# EasyEDA Pro project ProPrj_风扇控制_2024-12-11.epro

# Schematic Schematic1
Board Name: Board1; Create Date: 2024-11-12; Page Name: P1; Project Name: 风扇控制; Schematic Name: Schematic1; Update Date: 2024-11-16; Company: 嘉立创EDA; Page Size: A4; Version: V1.0
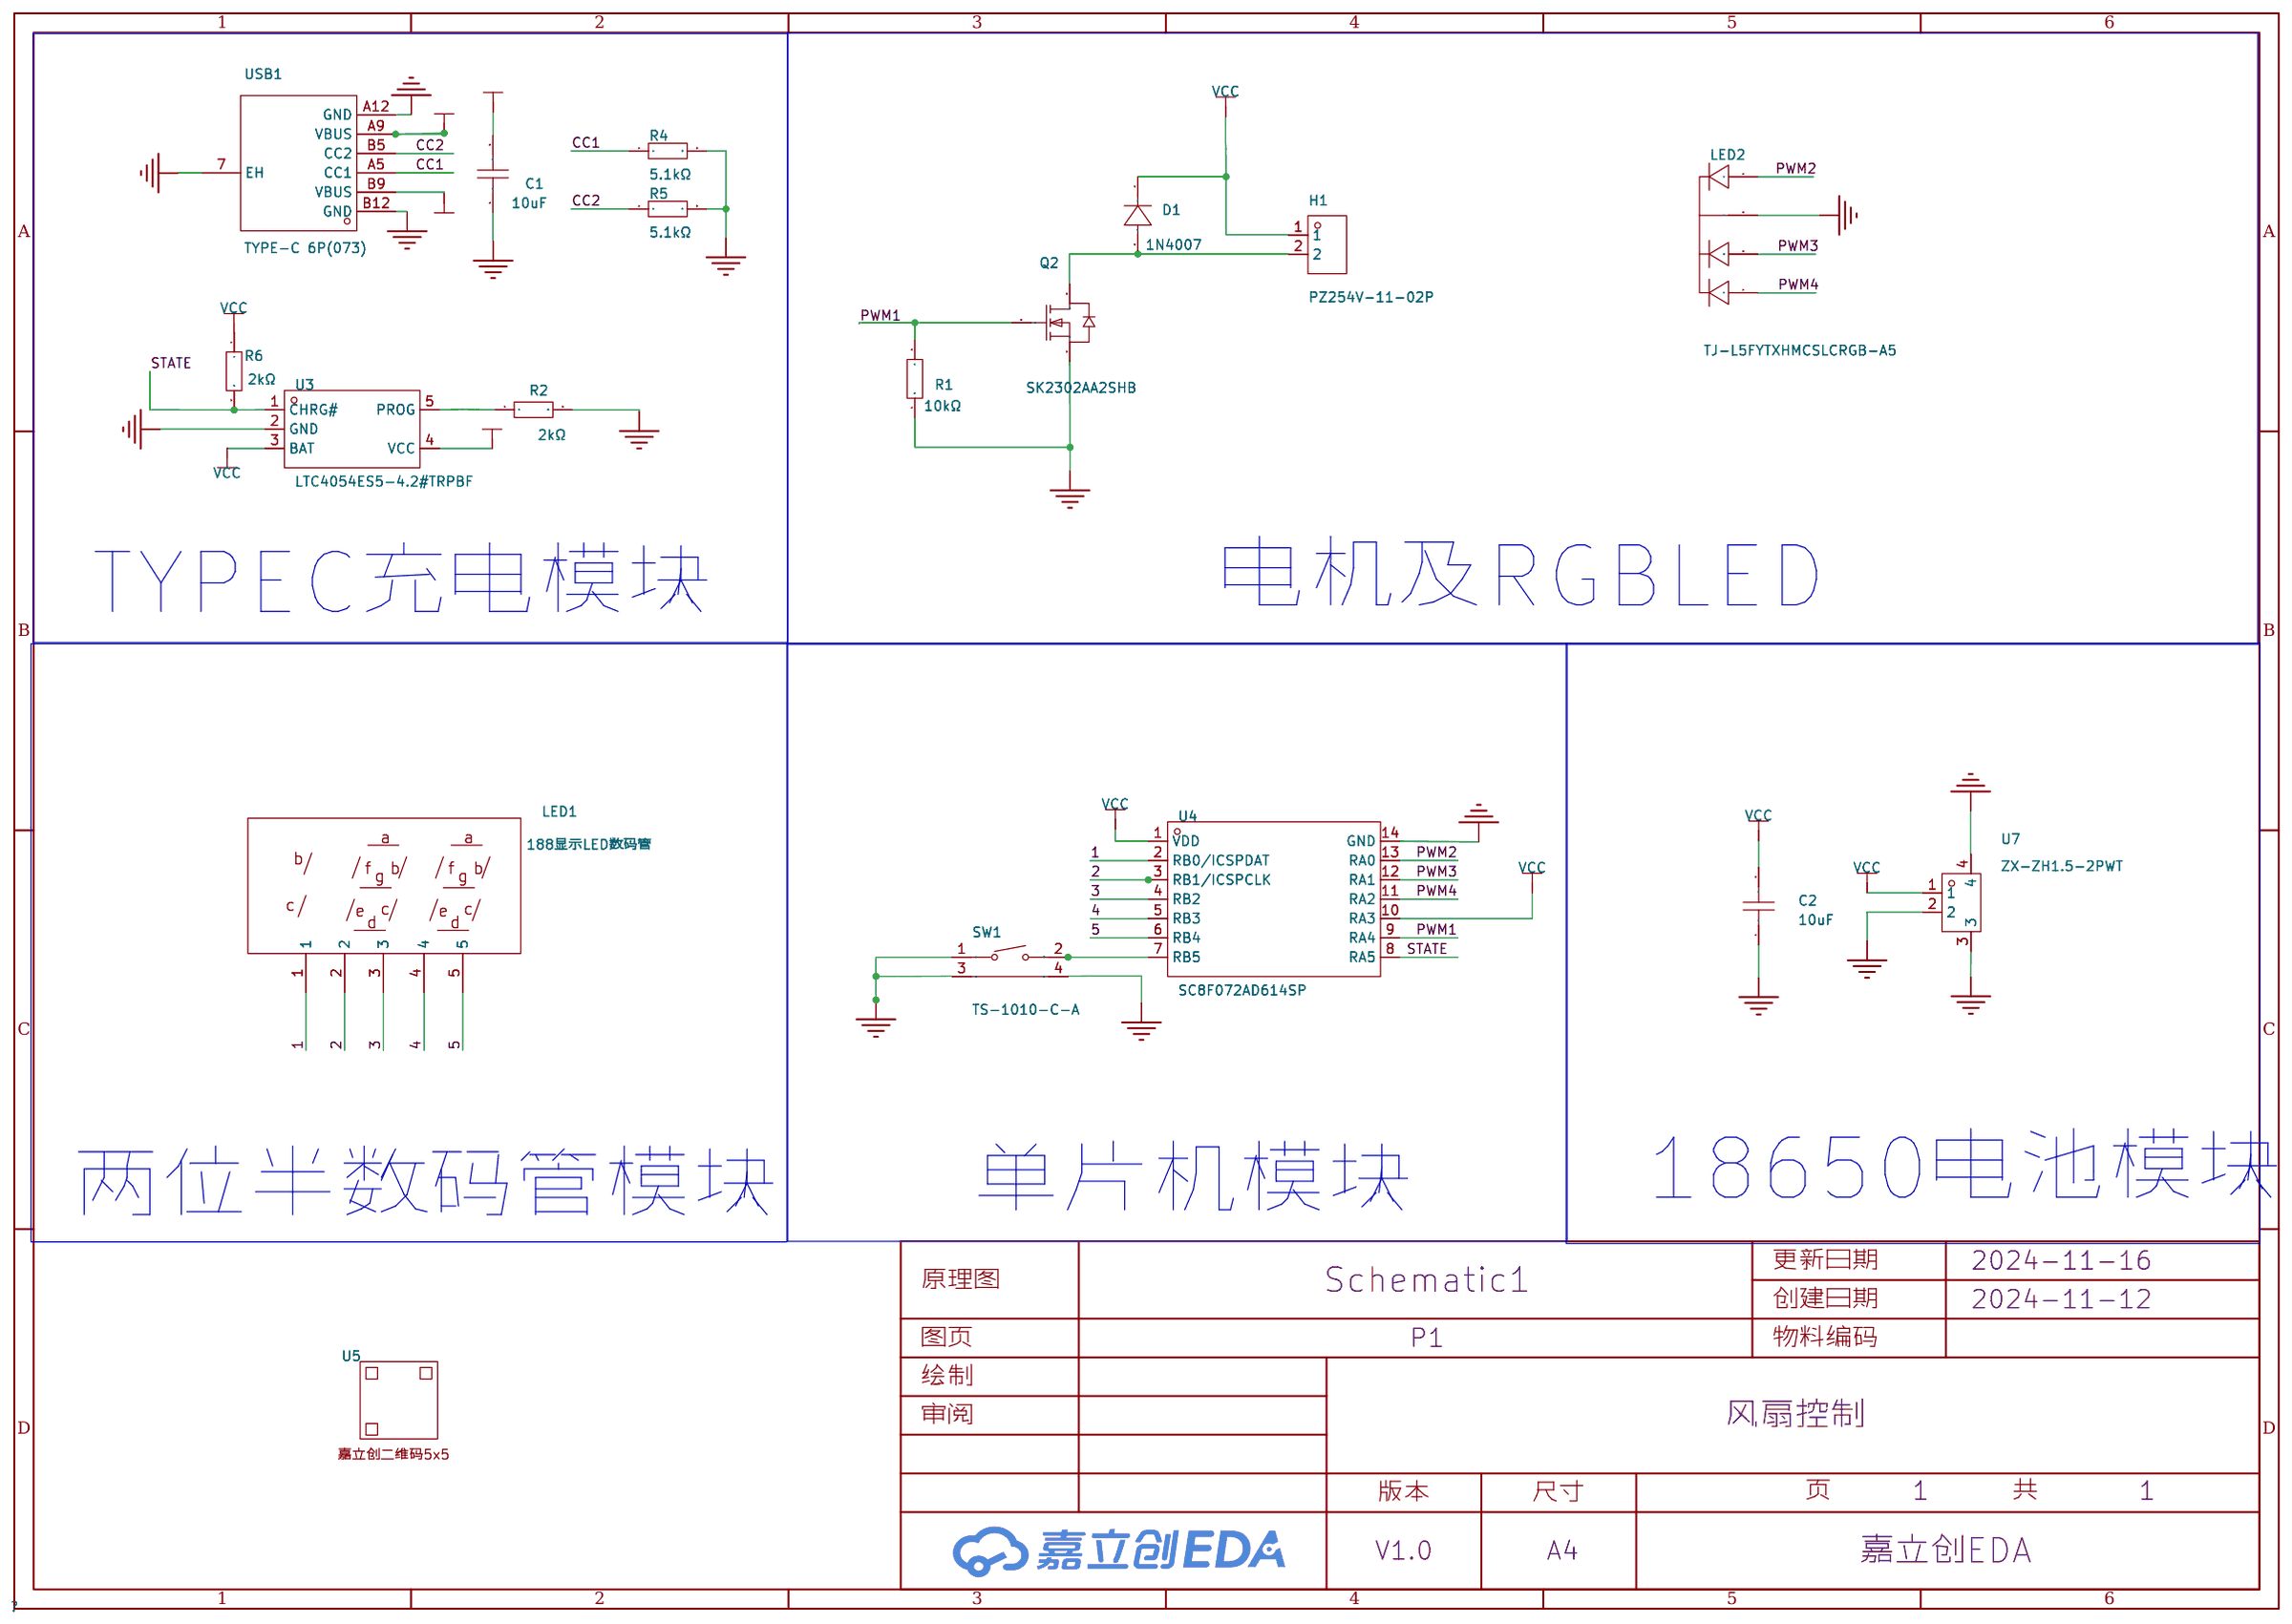
[diagram p0: schematic sheet]

## Parts
C1  10uF  [C0805]
C2  10uF  [C0805]
D1  1N4007  [SMA_L4.3-W2.5-LS5.0-RD]
H1  PZ254V-11-02P  [3.96-2P]
LED1  188显示LED数码管  [LED-TH_C9900059527]
LED2  TJ-L5FYTXHMCSLCRGB-A5  [LED-TH_4P-BD5.8-P1.30]
Q2  SK2302AA2SHB  [SOT-23-3_L2.9-W1.6-P1.90-LS2.8-BR]
R1  10kΩ  [R0805]
R2  2kΩ  [R0805]
R4  5.1kΩ  [R0805]
R5  5.1kΩ  [R0805]
R6  2kΩ  [R0805]
SW1  TS-1010-C-A  [KEY-SMD_TX-1010-X-X]
U3  LTC4054ES5-4.2#TRPBF  [TSOT-23-5_L2.9-W1.6-P0.95-LS2.8-BL]
U4  SC8F072AD614SP  [SOP-14_L8.7-W3.9-P1.27-LS6.0-BL]
U5  -  [JLC-QRCODE-5x5]
U7  ZX-ZH1.5-2PWT  [CONN-SMD_2P-P1.50_ZX-ZH1.5-2PWT]
USB1  TYPE-C 6P(073)  [TYPE-C-SMD_TYPE-C-6P_5]

## Library data of the parts
C1 C2 = CGA0805X5R106K350MT: 容值:10uF;精度:±10%;额定电压:35V;材质(温度系数):X5R;; LCSC Part Name: 10uF ±10% 35V; Supplier Part: C6119888; Manufacturer: HRE(芯声); Supplier Footprint: 0805; JLCPCB Part Class: Extended Part; Supplier: LCSC; Tolerance: ±10%; Voltage Rated: 35V; Temperature Coefficient: X5R
D1 = 1N4007_C727081: 二极管配置:独立式;正向压降(Vf):1.1V@1A;直流反向耐压(Vr):1kV;整流电流:1A;; LCSC Part Name: 电压:1kV 电流:1A; Supplier Part: C727081; Manufacturer: TWGMC(台湾迪嘉); Supplier Footprint: SMA(DO-214AC); Datasheet: https://atta.szlcsc.com/upload/public/pdf/source/20200828/C727079_3A05254382567072883400655AE0ED46.pdf; Supplier: LCSC; Diode Configuration: 独立式; Forward Voltage (Vf@If): 1.1V@1A; Reverse Voltage (Vr): 1kV; Rectified Current: 1A; Reverse Leakage Current: 5uA
H1 = PZ254V-11-02P: 插针结构:1x2P;间距:2.54mm;行距:-;圆针/方针:方针;安装类型:直插;排数:单排;总PIN位数:2P;额定电流:-;额定电压:-;配合针长度:6mm;塑高:2.5mm;端接针长度:3mm;触头材质:黄铜;触头镀层:-;工作温度范围:-40℃~+105℃;颜色:黑色;; LCSC Part Name: 间距:2.54mm 1x2P 直插 方针; Supplier Part: C492401; Manufacturer: XFCN(兴飞); Supplier Footprint: 插件,P=2.54mm; JLCPCB Part Class: 扩展库; Datasheet: https://atta.szlcsc.com/upload/public/pdf/source/20200309/C492401_A812433581A9B211A7FFA413ADDFF0E5.pdf; Supplier: LCSC; Pin Structure: 1x2P; Pitch: 2.54mm; Circluar Pins/Square Pins: 方针; Mounting Type: 直插; Number of Rows: 单排; Number of Pins: 2P; Length of Mating Pin: 6mm; Insulation Height: 2.5mm; Length of End Connection Pin: 3mm; Contact Material: 黄铜; Operating Temperature Range: -40℃~+105℃; Color: 黑色
LED1 = 188显示LED数码管: Supplier Part: C9900059527; Supplier Footprint: DIP; Supplier: LCSC
LED2 = TJ-L5FYTXHMCSLCRGB-A5: 5MM圆头共阴RGB,F5圆头共阴RGB,三色共阴RGB; LCSC Part Name: RGB三色; Supplier Part: C330759; Manufacturer: TOGIALED(统佳); Supplier Footprint: 插件,D=5mm; JLCPCB Part Class: 扩展库; Datasheet: https://atta.szlcsc.com/upload/public/pdf/source/20181220/C330759_95C409BF14EF1DFA3353C5A3EA3A53E5.pdf; Supplier: LCSC
Q2 = SK2302AA2SHB: 类型:1个N沟道;漏源电压(Vdss):18V;连续漏极电流(Id):3.6A;功率(Pd):700mW;导通电阻(RDS(on)@Vgs,Id):80mΩ@4.5V,3.6A;阈值电压(Vgs(th)@Id):1.3V@250uA;; LCSC Part Name: 1个N沟道 耐压:18V 电流:3.6A; Supplier Part: C118152; Manufacturer: SHIKUES(时科); Supplier Footprint: SC-59; JLCPCB Part Class: 扩展库; Datasheet: https://atta.szlcsc.com/upload/public/pdf/source/20191016/C118152_81A4E420DEC0954945921A05121CC0AB.pdf; Supplier: LCSC; Type: 1个N沟道; Drain Source Voltage (Vdss): 18V; Continuous Drain Current (Id): 3.6A; Power Dissipation (Pd): 700mW; Drain Source On Resistance (RDS(on)@Vgs,Id): 80mΩ@4.5V,3.6A; Gate Threshold Voltage (Vgs(th)@Id): 1.3V@250uA; Total Gate Charge (Qg@Vgs): 4nC; Input Capacitance (Ciss@Vds): 300pF@10V; Reverse Transfer Capacitance (Crss@Vds): 80pF@10V
R1 = 0805W8F1002T5E_C17414: 电阻类型:厚膜电阻;阻值:10kΩ;精度:±1%;功率:125mW;最大工作电压:150V;温度系数:±100ppm/℃;; LCSC Part Name: 10kΩ ±1% 125mW 厚膜电阻; Supplier Part: C17414; Manufacturer: UNI-ROYAL(厚声); Manufacturer Part: 0805W8F1002T5E; Supplier Footprint: 0805; JLCPCB Part Class: Basic Part; Datasheet: https://atta.szlcsc.com/upload/public/pdf/source/20200306/C422600_1E6D84923E4A46A82E41ADD87F860B5C.pdf; Supplier: LCSC; Type: 厚膜电阻; Tolerance: ±1%; Power(Watts): 125mW; Overload Voltage (Max): 150V; Temperature Coefficient: ±100ppm/℃; Operating Temperature Range: -55℃~+155℃
R2 R6 = 0805W8F2001T5E: 电阻类型:厚膜电阻;阻值:2kΩ;精度:±1%;功率:125mW;最大工作电压:150V;温度系数:±100ppm/℃;; LCSC Part Name: 2kΩ ±1% 125mW 厚膜电阻; Supplier Part: C17604; Manufacturer: UNI-ROYAL(厚声); Supplier Footprint: 0805; JLCPCB Part Class: Basic Part; Datasheet: https://atta.szlcsc.com/upload/public/pdf/source/20200306/C422600_1E6D84923E4A46A82E41ADD87F860B5C.pdf; Supplier: LCSC; Type: 厚膜电阻; Tolerance: ±1%; Power(Watts): 125mW; Overload Voltage (Max): 150V; Temperature Coefficient: ±100ppm/℃; Operating Temperature Range: -55℃~+155℃
R4 R5 = 0805W8F5101T5E: 电阻类型:厚膜电阻;阻值:5.1kΩ;精度:±1%;功率:125mW;最大工作电压:150V;温度系数:±100ppm/℃;; LCSC Part Name: 5.1kΩ ±1% 125mW 厚膜电阻; Supplier Part: C27834; Manufacturer: UNI-ROYAL(厚声); Supplier Footprint: 0805; JLCPCB Part Class: Basic Part; Datasheet: https://atta.szlcsc.com/upload/public/pdf/source/20200306/C422600_1E6D84923E4A46A82E41ADD87F860B5C.pdf; Supplier: LCSC; Type: 厚膜电阻; Tolerance: ±1%; Power(Watts): 125mW; Overload Voltage (Max): 150V; Temperature Coefficient: ±100ppm/℃; Operating Temperature Range: -55℃~+155℃
SW1 = TS-1010-C-A: 电路结构:单刀单掷;按钮形状:矩形按钮;作用力:260gf;安装方式:卧贴;开关长度:2.3mm;开关宽度:4.7mm;开关高度:3.5mm;带支架:不带;触点电流:50mA;额定电压(AC):-;额定电压(DC):12V;额定功率:-;绝缘电阻:-;带灯:无;机械寿命:10万次;; LCSC Part Name: 2.3*4.7*3.5mm 卧贴 轻触开关; Supplier Part: C692458; Manufacturer: XKB Connectivity(中国星坤); Supplier Footprint: SMD; JLCPCB Part Class: 扩展库; Datasheet: https://atta.szlcsc.com/upload/public/pdf/source/20211011/09621D275CE0F472C941775DFBBCCC96.pdf; Supplier: LCSC; Circuit: 单刀单掷; Actuator Style: 矩形按钮; Operating Force: 260gf; Mounting Style: 卧贴; Switch Length: 2.3mm; Switch Width: 4.7mm; Switch Height: 3.5mm; Strike Gundam: 不带; Contact Current: 50mA; Voltage Rating (DC): 12V; Actuator/Cap Color: 黑色; With Lamp: 无; Mechanical Life: 10万次; Operating Temperature: -30℃~+85℃
U3 = LTC4054ES5-4.2#TRPBF: 电源电压:6.5V;最大充电电流:800mA;电池类型:锂离子/聚合物;电池节数:1;; LCSC Part Name: 采用 ThinSOT 封装并具有热调节功能的独立线性锂离子电池充电器; Supplier Part: C462648; Manufacturer: ADI(亚德诺); Supplier Footprint: TSOT-23-5; JLCPCB Part Class: 扩展库; Datasheet: https://atta.szlcsc.com/upload/public/pdf/source/20170712/C117064_1499832277334814248.pdf; Supplier: LCSC; Supply Voltage: 6.5V; Maximum Charge Current: 800mA; Type of Battery: 锂离子/聚合物; Number of Cells: 1; Operating Temperature: -40℃~+85℃
U4 = SC8F072AD614SP: Supplier Part: C9900089081; Supplier Footprint: SOP14; JLCPCB Part Class: 扩展库; Supplier: LCSC
U5 = 嘉立创二维码5x5
U7 = ZX-ZH1.5-2PWT: 插针结构:1x2P;间距:1.5mm;安装方式:卧贴;参考系列:ZH;总PIN数:2P;排数:1;每排PIN数:2;行距:-;额定电流:1A;触头材质:黄铜;触头镀层:锡;工作温度范围:-25℃~+85℃;; LCSC Part Name: 1x2P 间距:1.5mm 卧贴 系列:ZH; Supplier Part: C19272405; Manufacturer: Megastar(兆星); Supplier Footprint: SMD,P=1.5mm,卧贴; JLCPCB Part Class: 扩展库; Datasheet: https://atta.szlcsc.com/upload/public/pdf/source/20231201/C5A824B953C40A6060EBF5A541254C86.pdf; Supplier: LCSC; Pins Structure: 1x2P; Pitch: 1.5mm; Mounting Style: 卧贴; Reference Series: ZH; Number of Pins: 2P; Number of Rows: 1; Number of PINs Per Row: 2; Current Rating (Max): 1A; Contact Material: 黄铜; Contact Plating: 锡; Operating Temperature Range: -25℃~+85℃
USB1 = TYPE-C 6P(073): 连接器类型:Type-C;标准:USB 3.1;公母:母;安装方式:卧贴;触点数量:6P;端口数量:1;额定电流 - 电源:3A;工作温度范围:-25℃~+85℃;; LCSC Part Name: Type-C 母 卧贴; Supplier Part: C668623; Manufacturer: SHOU HAN(首韩); Supplier Footprint: SMD; JLCPCB Part Class: 扩展库; Datasheet: https://atta.szlcsc.com/upload/public/pdf/source/20200618/C668623_A4B260DED7AC1949BAC6AE39E9F4CD80.pdf; Supplier: LCSC; Connector Type: Type-C; Standard: USB 3.1; Gender: 母; Mounting Style: 卧贴; Number of Contacts: 6P; Number of Ports: 1; Current Rating - Power (Max): 3A; Operating Temperature Range: -25℃~+85℃; Rated Voltage (Max): 5V; Connect-Disconnect Life: 1万次; Core Colour: 黑色

## Nets
+5V: U3.4(VCC) USB1.A9(VBUS) USB1.B9(VBUS)
GND: C1.1 C2.1 LED2.2(-) Q2.2(S) R1.1 R4.2 R5.2 U3.2(GND) U4.14(GND) U7.3 USB1.7(EH) USB1.A12(GND) USB1.B12(GND)
VCC: C2.2 D1.1(K) R6.1 U3.3(BAT) U4.1(VDD) U4.10(RA3)
1: LED1.1
2: LED1.2
3: LED1.3
4: LED1.4
5: LED1.5 U4.6(RB4)
CC1: R4.1 USB1.A5(CC1)
CC2: R5.1 USB1.B5(CC2)
PWM1: Q2.1(G) R1.2 U4.9(RA4)
PWM2: U4.13(RA0)
PWM3: U4.12(RA1)
PWM4: U4.11(RA2)
STATE: R6.2 U3.1(CHRG#) U4.8(RA5)
$1N2007: R2.1 U3.5(PROG)

Not connected (* = marked no-connect by the designer): C1 2; D1 2(A); H1 1 2; LED2 1 3 4; Q2 3(D); R2 2; SW1 1 2 3 4; U4 2(RB0/ICSPDAT) 3(RB1/ICSPCLK) 4(RB2) 5(RB3) 7(RB5); U7 1 2 4

## Notes on the sheet
- 电机及RGBLED
- TYPEC充电模块
- 18650电池模块
- 两位半数码管模块
- 单片机模块

# Schematic Schematic2
Board Name: PCB5; Create Date: 2024-12-02; Page Name: P1; Project Name: 风扇控制; Schematic Name: Schematic2; Update Date: 2024-12-02; Company: 嘉立创EDA; Page Size: A4; Version: V1.0
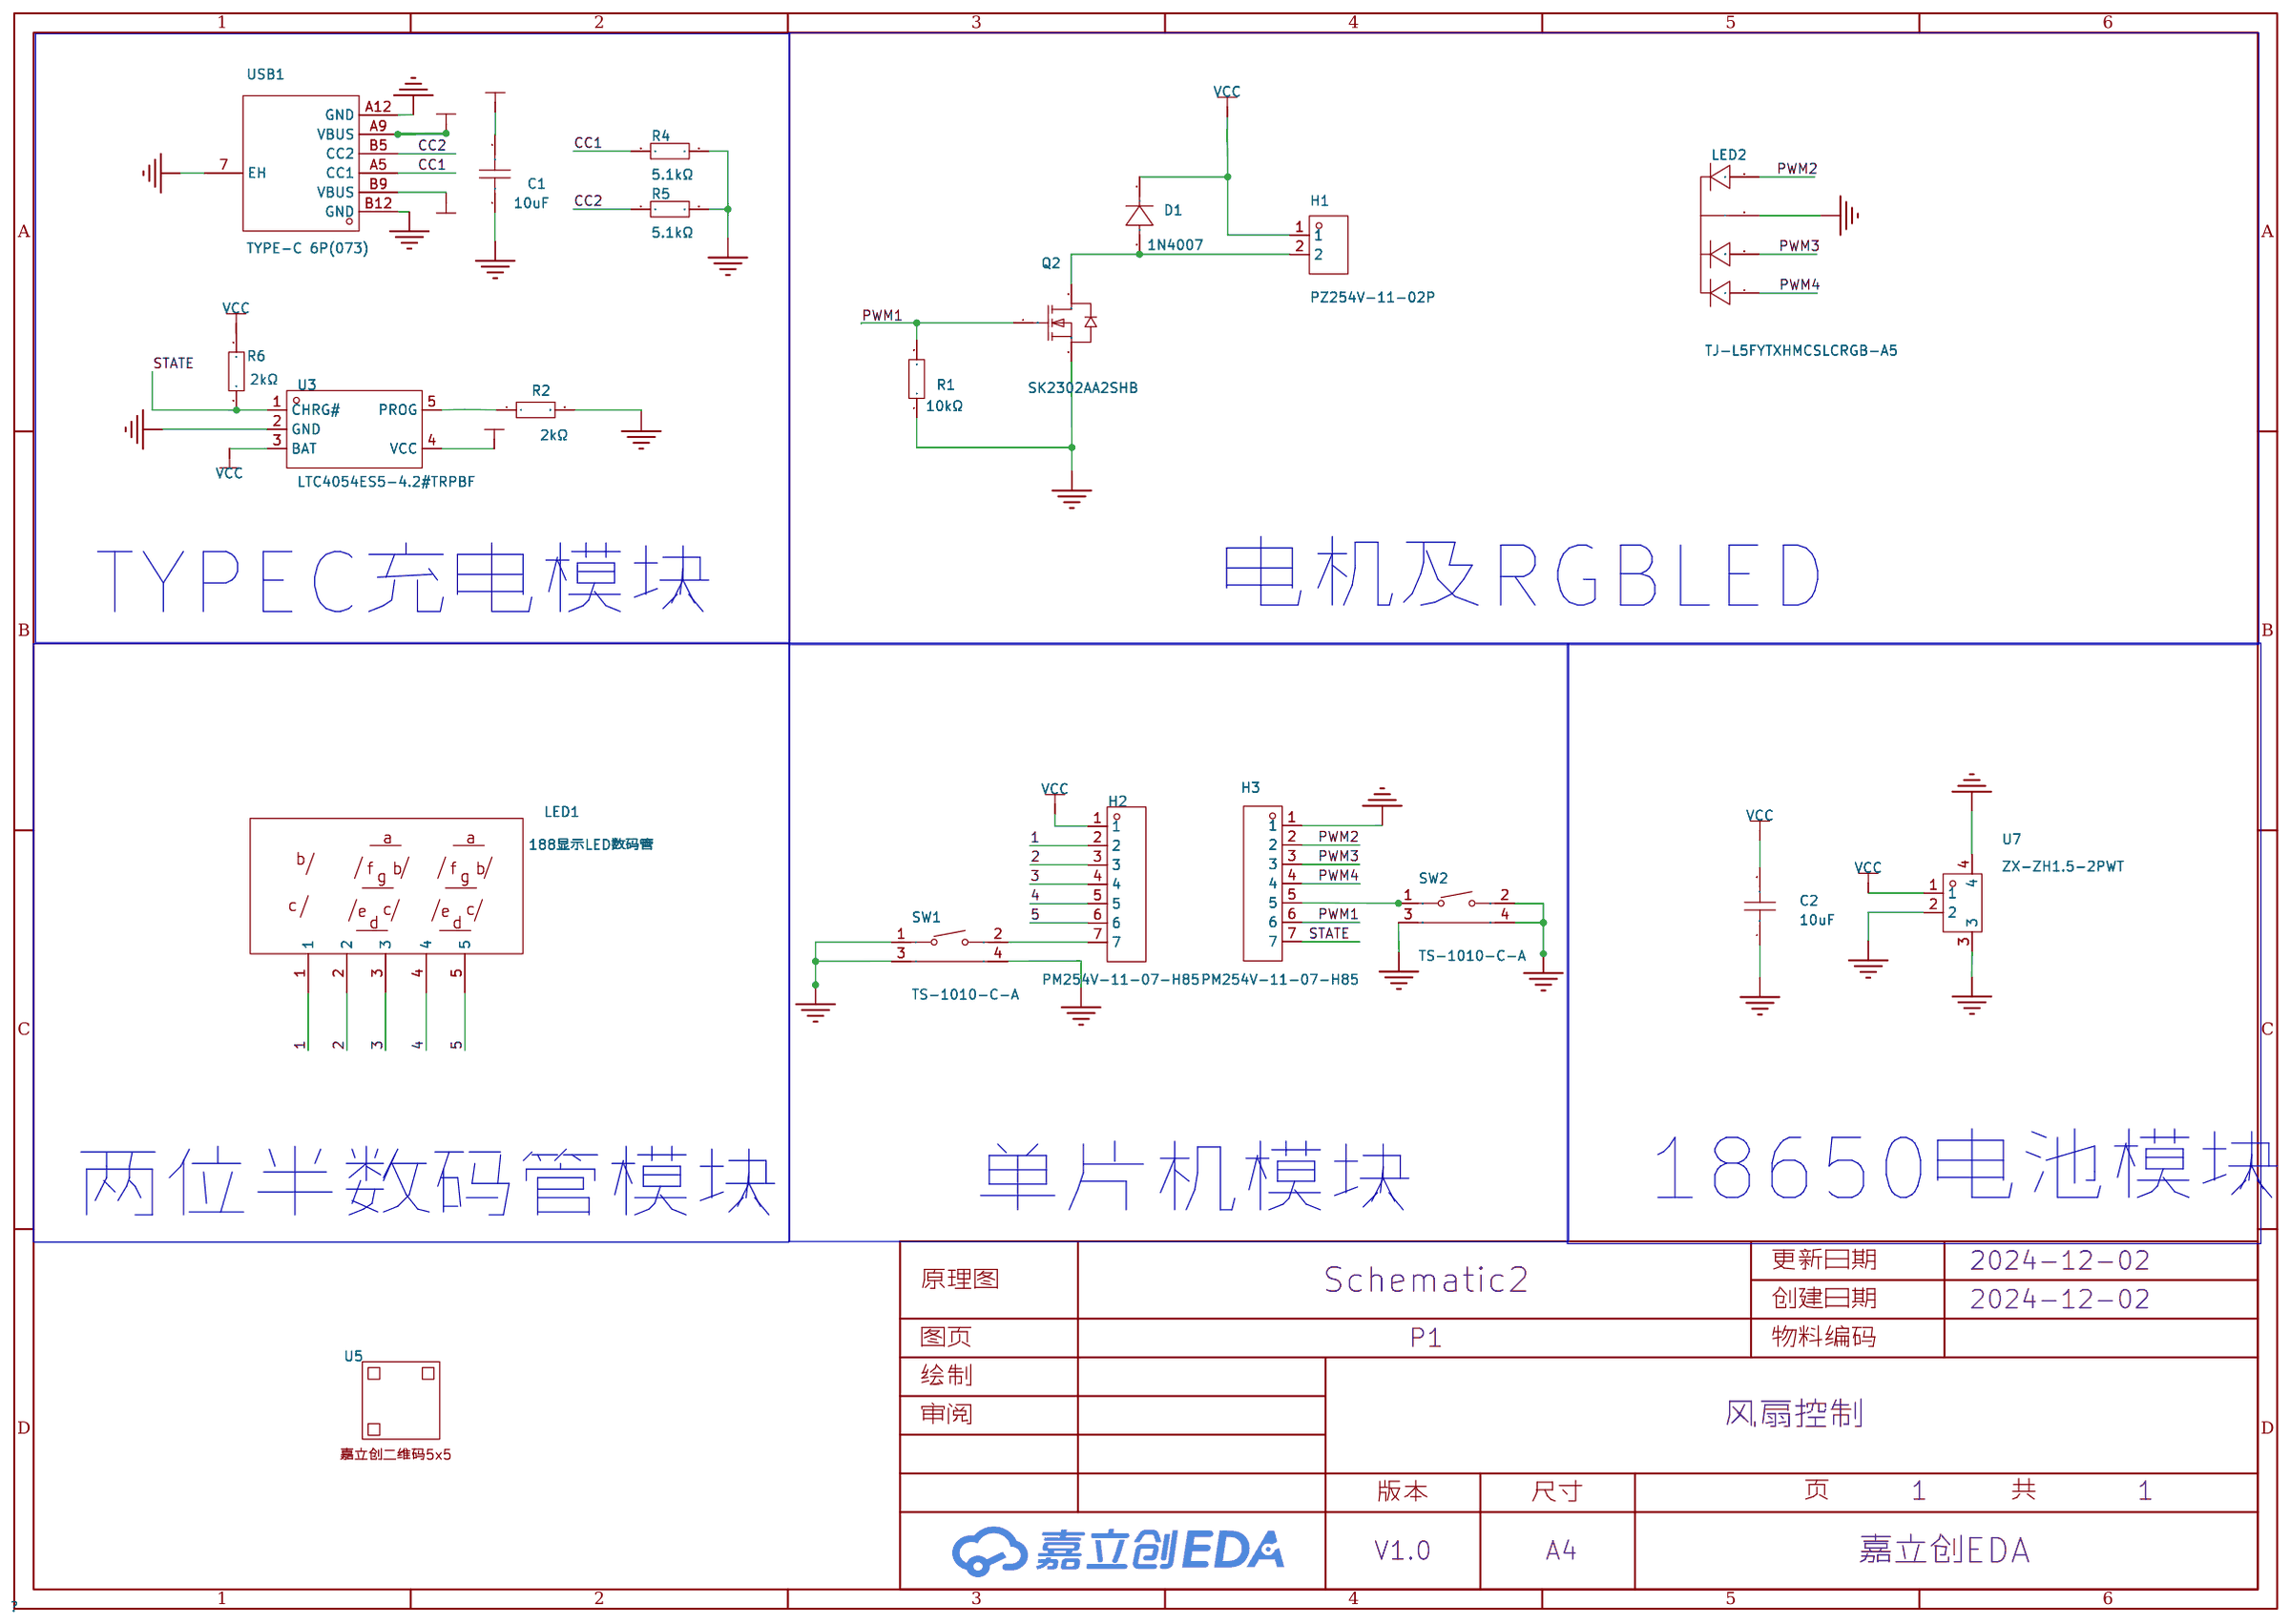
[diagram p1: schematic sheet]

## Parts
C1  10uF  [C0805]
C2  10uF  [C0805]
D1  1N4007  [SMA_L4.3-W2.5-LS5.0-RD]
H1  PZ254V-11-02P  [3.96-2P]
H2  PM254V-11-07-H85  [HDR-TH_7P-P2.54-V-F]
H3  PM254V-11-07-H85  [HDR-TH_7P-P2.54-V-F]
LED1  188显示LED数码管  [LED-TH_C9900059527]
LED2  TJ-L5FYTXHMCSLCRGB-A5  [LED-TH_4P-BD5.8-P1.30]
Q2  SK2302AA2SHB  [SOT-23-3_L2.9-W1.6-P1.90-LS2.8-BR]
R1  10kΩ  [R0805]
R2  2kΩ  [R0805]
R4  5.1kΩ  [R0805]
R5  5.1kΩ  [R0805]
R6  2kΩ  [R0805]
SW1  TS-1010-C-A  [KEY-SMD_TX-1010-X-X]
SW2  TS-1010-C-A  [KEY-SMD_TX-1010-X-X]
U3  LTC4054ES5-4.2#TRPBF  [TSOT-23-5_L2.9-W1.6-P0.95-LS2.8-BL]
U5  -  [JLC-QRCODE-5x5]
U7  ZX-ZH1.5-2PWT  [CONN-SMD_2P-P1.50_ZX-ZH1.5-2PWT]
USB1  TYPE-C 6P(073)  [TYPE-C-SMD_TYPE-C-6P_5]

## Library data of the parts
C1 C2 = CGA0805X5R106K350MT: 容值:10uF;精度:±10%;额定电压:35V;材质(温度系数):X5R;; LCSC Part Name: 10uF ±10% 35V; Supplier Part: C6119888; Manufacturer: HRE(芯声); Supplier Footprint: 0805; JLCPCB Part Class: Extended Part; Supplier: LCSC; Tolerance: ±10%; Voltage Rated: 35V; Temperature Coefficient: X5R
D1 = 1N4007_C727081: 二极管配置:独立式;正向压降(Vf):1.1V@1A;直流反向耐压(Vr):1kV;整流电流:1A;; LCSC Part Name: 电压:1kV 电流:1A; Supplier Part: C727081; Manufacturer: TWGMC(台湾迪嘉); Supplier Footprint: SMA(DO-214AC); Datasheet: https://atta.szlcsc.com/upload/public/pdf/source/20200828/C727079_3A05254382567072883400655AE0ED46.pdf; Supplier: LCSC; Diode Configuration: 独立式; Forward Voltage (Vf@If): 1.1V@1A; Reverse Voltage (Vr): 1kV; Rectified Current: 1A; Reverse Leakage Current: 5uA
H1 = PZ254V-11-02P: 插针结构:1x2P;间距:2.54mm;行距:-;圆针/方针:方针;安装类型:直插;排数:单排;总PIN位数:2P;额定电流:-;额定电压:-;配合针长度:6mm;塑高:2.5mm;端接针长度:3mm;触头材质:黄铜;触头镀层:-;工作温度范围:-40℃~+105℃;颜色:黑色;; LCSC Part Name: 间距:2.54mm 1x2P 直插 方针; Supplier Part: C492401; Manufacturer: XFCN(兴飞); Supplier Footprint: 插件,P=2.54mm; JLCPCB Part Class: 扩展库; Datasheet: https://atta.szlcsc.com/upload/public/pdf/source/20200309/C492401_A812433581A9B211A7FFA413ADDFF0E5.pdf; Supplier: LCSC; Pin Structure: 1x2P; Pitch: 2.54mm; Circluar Pins/Square Pins: 方针; Mounting Type: 直插; Number of Rows: 单排; Number of Pins: 2P; Length of Mating Pin: 6mm; Insulation Height: 2.5mm; Length of End Connection Pin: 3mm; Contact Material: 黄铜; Operating Temperature Range: -40℃~+105℃; Color: 黑色
H2 H3 = PM254V-11-07-H85: 插孔结构:1x7P;间距:2.54mm;行距:-;圆孔/方孔:方孔;安装类型:直插;排数:单排;总孔位数:7P;额定电流:3A;额定电压:250V;插孔方向:顶部;塑高:-;工作温度范围:-40℃~+105℃;; LCSC Part Name: 间距:2.54mm 1x7P 直插; Supplier Part: C2832270; Manufacturer: XFCN(兴飞); Supplier Footprint: 插件,P=2.54mm; JLCPCB Part Class: 扩展库; Datasheet: https://atta.szlcsc.com/upload/public/pdf/source/20210514/C2832270_F424CC0071A81298BFB56B53406F9842.pdf; Supplier: LCSC; Holes Structure: 1x7P; Pitch: 2.54mm; Circular Hole / Square Hole: 方孔; Mounting Type: 直插; Number of Rows: 单排; Number of Holes: 7P; Current Rating (Max): 3A; Voltage Rating (Max): 250V; Holes Direction: 顶部; Operating Temperature Range: -40℃~+105℃
LED1 = 188显示LED数码管: Supplier Part: C9900059527; Supplier Footprint: DIP; Supplier: LCSC
LED2 = TJ-L5FYTXHMCSLCRGB-A5: 5MM圆头共阴RGB,F5圆头共阴RGB,三色共阴RGB; LCSC Part Name: RGB三色; Supplier Part: C330759; Manufacturer: TOGIALED(统佳); Supplier Footprint: 插件,D=5mm; JLCPCB Part Class: 扩展库; Datasheet: https://atta.szlcsc.com/upload/public/pdf/source/20181220/C330759_95C409BF14EF1DFA3353C5A3EA3A53E5.pdf; Supplier: LCSC
Q2 = SK2302AA2SHB: 类型:1个N沟道;漏源电压(Vdss):18V;连续漏极电流(Id):3.6A;功率(Pd):700mW;导通电阻(RDS(on)@Vgs,Id):80mΩ@4.5V,3.6A;阈值电压(Vgs(th)@Id):1.3V@250uA;; LCSC Part Name: 1个N沟道 耐压:18V 电流:3.6A; Supplier Part: C118152; Manufacturer: SHIKUES(时科); Supplier Footprint: SC-59; JLCPCB Part Class: 扩展库; Datasheet: https://atta.szlcsc.com/upload/public/pdf/source/20191016/C118152_81A4E420DEC0954945921A05121CC0AB.pdf; Supplier: LCSC; Type: 1个N沟道; Drain Source Voltage (Vdss): 18V; Continuous Drain Current (Id): 3.6A; Power Dissipation (Pd): 700mW; Drain Source On Resistance (RDS(on)@Vgs,Id): 80mΩ@4.5V,3.6A; Gate Threshold Voltage (Vgs(th)@Id): 1.3V@250uA; Total Gate Charge (Qg@Vgs): 4nC; Input Capacitance (Ciss@Vds): 300pF@10V; Reverse Transfer Capacitance (Crss@Vds): 80pF@10V
R1 = 0805W8F1002T5E_C17414: 电阻类型:厚膜电阻;阻值:10kΩ;精度:±1%;功率:125mW;最大工作电压:150V;温度系数:±100ppm/℃;; LCSC Part Name: 10kΩ ±1% 125mW 厚膜电阻; Supplier Part: C17414; Manufacturer: UNI-ROYAL(厚声); Manufacturer Part: 0805W8F1002T5E; Supplier Footprint: 0805; JLCPCB Part Class: Basic Part; Datasheet: https://atta.szlcsc.com/upload/public/pdf/source/20200306/C422600_1E6D84923E4A46A82E41ADD87F860B5C.pdf; Supplier: LCSC; Type: 厚膜电阻; Tolerance: ±1%; Power(Watts): 125mW; Overload Voltage (Max): 150V; Temperature Coefficient: ±100ppm/℃; Operating Temperature Range: -55℃~+155℃
R2 R6 = 0805W8F2001T5E: 电阻类型:厚膜电阻;阻值:2kΩ;精度:±1%;功率:125mW;最大工作电压:150V;温度系数:±100ppm/℃;; LCSC Part Name: 2kΩ ±1% 125mW 厚膜电阻; Supplier Part: C17604; Manufacturer: UNI-ROYAL(厚声); Supplier Footprint: 0805; JLCPCB Part Class: Basic Part; Datasheet: https://atta.szlcsc.com/upload/public/pdf/source/20200306/C422600_1E6D84923E4A46A82E41ADD87F860B5C.pdf; Supplier: LCSC; Type: 厚膜电阻; Tolerance: ±1%; Power(Watts): 125mW; Overload Voltage (Max): 150V; Temperature Coefficient: ±100ppm/℃; Operating Temperature Range: -55℃~+155℃
R4 R5 = 0805W8F5101T5E: 电阻类型:厚膜电阻;阻值:5.1kΩ;精度:±1%;功率:125mW;最大工作电压:150V;温度系数:±100ppm/℃;; LCSC Part Name: 5.1kΩ ±1% 125mW 厚膜电阻; Supplier Part: C27834; Manufacturer: UNI-ROYAL(厚声); Supplier Footprint: 0805; JLCPCB Part Class: Basic Part; Datasheet: https://atta.szlcsc.com/upload/public/pdf/source/20200306/C422600_1E6D84923E4A46A82E41ADD87F860B5C.pdf; Supplier: LCSC; Type: 厚膜电阻; Tolerance: ±1%; Power(Watts): 125mW; Overload Voltage (Max): 150V; Temperature Coefficient: ±100ppm/℃; Operating Temperature Range: -55℃~+155℃
SW1 SW2 = TS-1010-C-A: 电路结构:单刀单掷;按钮形状:矩形按钮;作用力:260gf;安装方式:卧贴;开关长度:2.3mm;开关宽度:4.7mm;开关高度:3.5mm;带支架:不带;触点电流:50mA;额定电压(AC):-;额定电压(DC):12V;额定功率:-;绝缘电阻:-;带灯:无;机械寿命:10万次;; LCSC Part Name: 2.3*4.7*3.5mm 卧贴 轻触开关; Supplier Part: C692458; Manufacturer: XKB Connectivity(中国星坤); Supplier Footprint: SMD; JLCPCB Part Class: 扩展库; Datasheet: https://atta.szlcsc.com/upload/public/pdf/source/20211011/09621D275CE0F472C941775DFBBCCC96.pdf; Supplier: LCSC; Circuit: 单刀单掷; Actuator Style: 矩形按钮; Operating Force: 260gf; Mounting Style: 卧贴; Switch Length: 2.3mm; Switch Width: 4.7mm; Switch Height: 3.5mm; Strike Gundam: 不带; Contact Current: 50mA; Voltage Rating (DC): 12V; Actuator/Cap Color: 黑色; With Lamp: 无; Mechanical Life: 10万次; Operating Temperature: -30℃~+85℃
U3 = LTC4054ES5-4.2#TRPBF: 电源电压:6.5V;最大充电电流:800mA;电池类型:锂离子/聚合物;电池节数:1;; LCSC Part Name: 采用 ThinSOT 封装并具有热调节功能的独立线性锂离子电池充电器; Supplier Part: C462648; Manufacturer: ADI(亚德诺); Supplier Footprint: TSOT-23-5; JLCPCB Part Class: 扩展库; Datasheet: https://atta.szlcsc.com/upload/public/pdf/source/20170712/C117064_1499832277334814248.pdf; Supplier: LCSC; Supply Voltage: 6.5V; Maximum Charge Current: 800mA; Type of Battery: 锂离子/聚合物; Number of Cells: 1; Operating Temperature: -40℃~+85℃
U5 = 嘉立创二维码5x5
U7 = ZX-ZH1.5-2PWT: 插针结构:1x2P;间距:1.5mm;安装方式:卧贴;参考系列:ZH;总PIN数:2P;排数:1;每排PIN数:2;行距:-;额定电流:1A;触头材质:黄铜;触头镀层:锡;工作温度范围:-25℃~+85℃;; LCSC Part Name: 1x2P 间距:1.5mm 卧贴 系列:ZH; Supplier Part: C19272405; Manufacturer: Megastar(兆星); Supplier Footprint: SMD,P=1.5mm,卧贴; JLCPCB Part Class: 扩展库; Datasheet: https://atta.szlcsc.com/upload/public/pdf/source/20231201/C5A824B953C40A6060EBF5A541254C86.pdf; Supplier: LCSC; Pins Structure: 1x2P; Pitch: 1.5mm; Mounting Style: 卧贴; Reference Series: ZH; Number of Pins: 2P; Number of Rows: 1; Number of PINs Per Row: 2; Current Rating (Max): 1A; Contact Material: 黄铜; Contact Plating: 锡; Operating Temperature Range: -25℃~+85℃
USB1 = TYPE-C 6P(073): 连接器类型:Type-C;标准:USB 3.1;公母:母;安装方式:卧贴;触点数量:6P;端口数量:1;额定电流 - 电源:3A;工作温度范围:-25℃~+85℃;; LCSC Part Name: Type-C 母 卧贴; Supplier Part: C668623; Manufacturer: SHOU HAN(首韩); Supplier Footprint: SMD; JLCPCB Part Class: 扩展库; Datasheet: https://atta.szlcsc.com/upload/public/pdf/source/20200618/C668623_A4B260DED7AC1949BAC6AE39E9F4CD80.pdf; Supplier: LCSC; Connector Type: Type-C; Standard: USB 3.1; Gender: 母; Mounting Style: 卧贴; Number of Contacts: 6P; Number of Ports: 1; Current Rating - Power (Max): 3A; Operating Temperature Range: -25℃~+85℃; Rated Voltage (Max): 5V; Connect-Disconnect Life: 1万次; Core Colour: 黑色

## Nets
+5V: U3.4(VCC) USB1.A9(VBUS) USB1.B9(VBUS)
GND: C1.1 C2.1 LED2.2(-) Q2.2(S) R1.1 R4.2 R5.2 SW2.4 U3.2(GND) U7.3 USB1.7(EH) USB1.A12(GND) USB1.B12(GND)
VCC: C2.2 D1.1(K) R6.1 U3.3(BAT)
1: LED1.1
2: LED1.2
3: LED1.3
4: LED1.4
5: LED1.5
CC1: R4.1 USB1.A5(CC1)
CC2: R5.1 USB1.B5(CC2)
PWM1: Q2.1(G) R1.2
STATE: R6.2 U3.1(CHRG#)
$1N1166: R2.1 U3.5(PROG)
Net-(H3-5): H3.5 SW2.1

Not connected (* = marked no-connect by the designer): C1 2; D1 2(A); H1 1 2; H2 1 2 3 4 5 6 7; H3 1 2 3 4 6 7; LED2 1 3 4; Q2 3(D); R2 2; SW1 1 2 3 4; SW2 2 3; U7 1 2 4

## Notes on the sheet
- 电机及RGBLED
- TYPEC充电模块
- 18650电池模块
- 两位半数码管模块
- 单片机模块

# Schematic Schematic3
Board Name: Board2; Create Date: 2024-12-02; Page Name: P1; Project Name: 风扇控制; Schematic Name: Schematic3; Update Date: 2024-12-02; Company: 嘉立创EDA; Page Size: A4; Version: V1.0
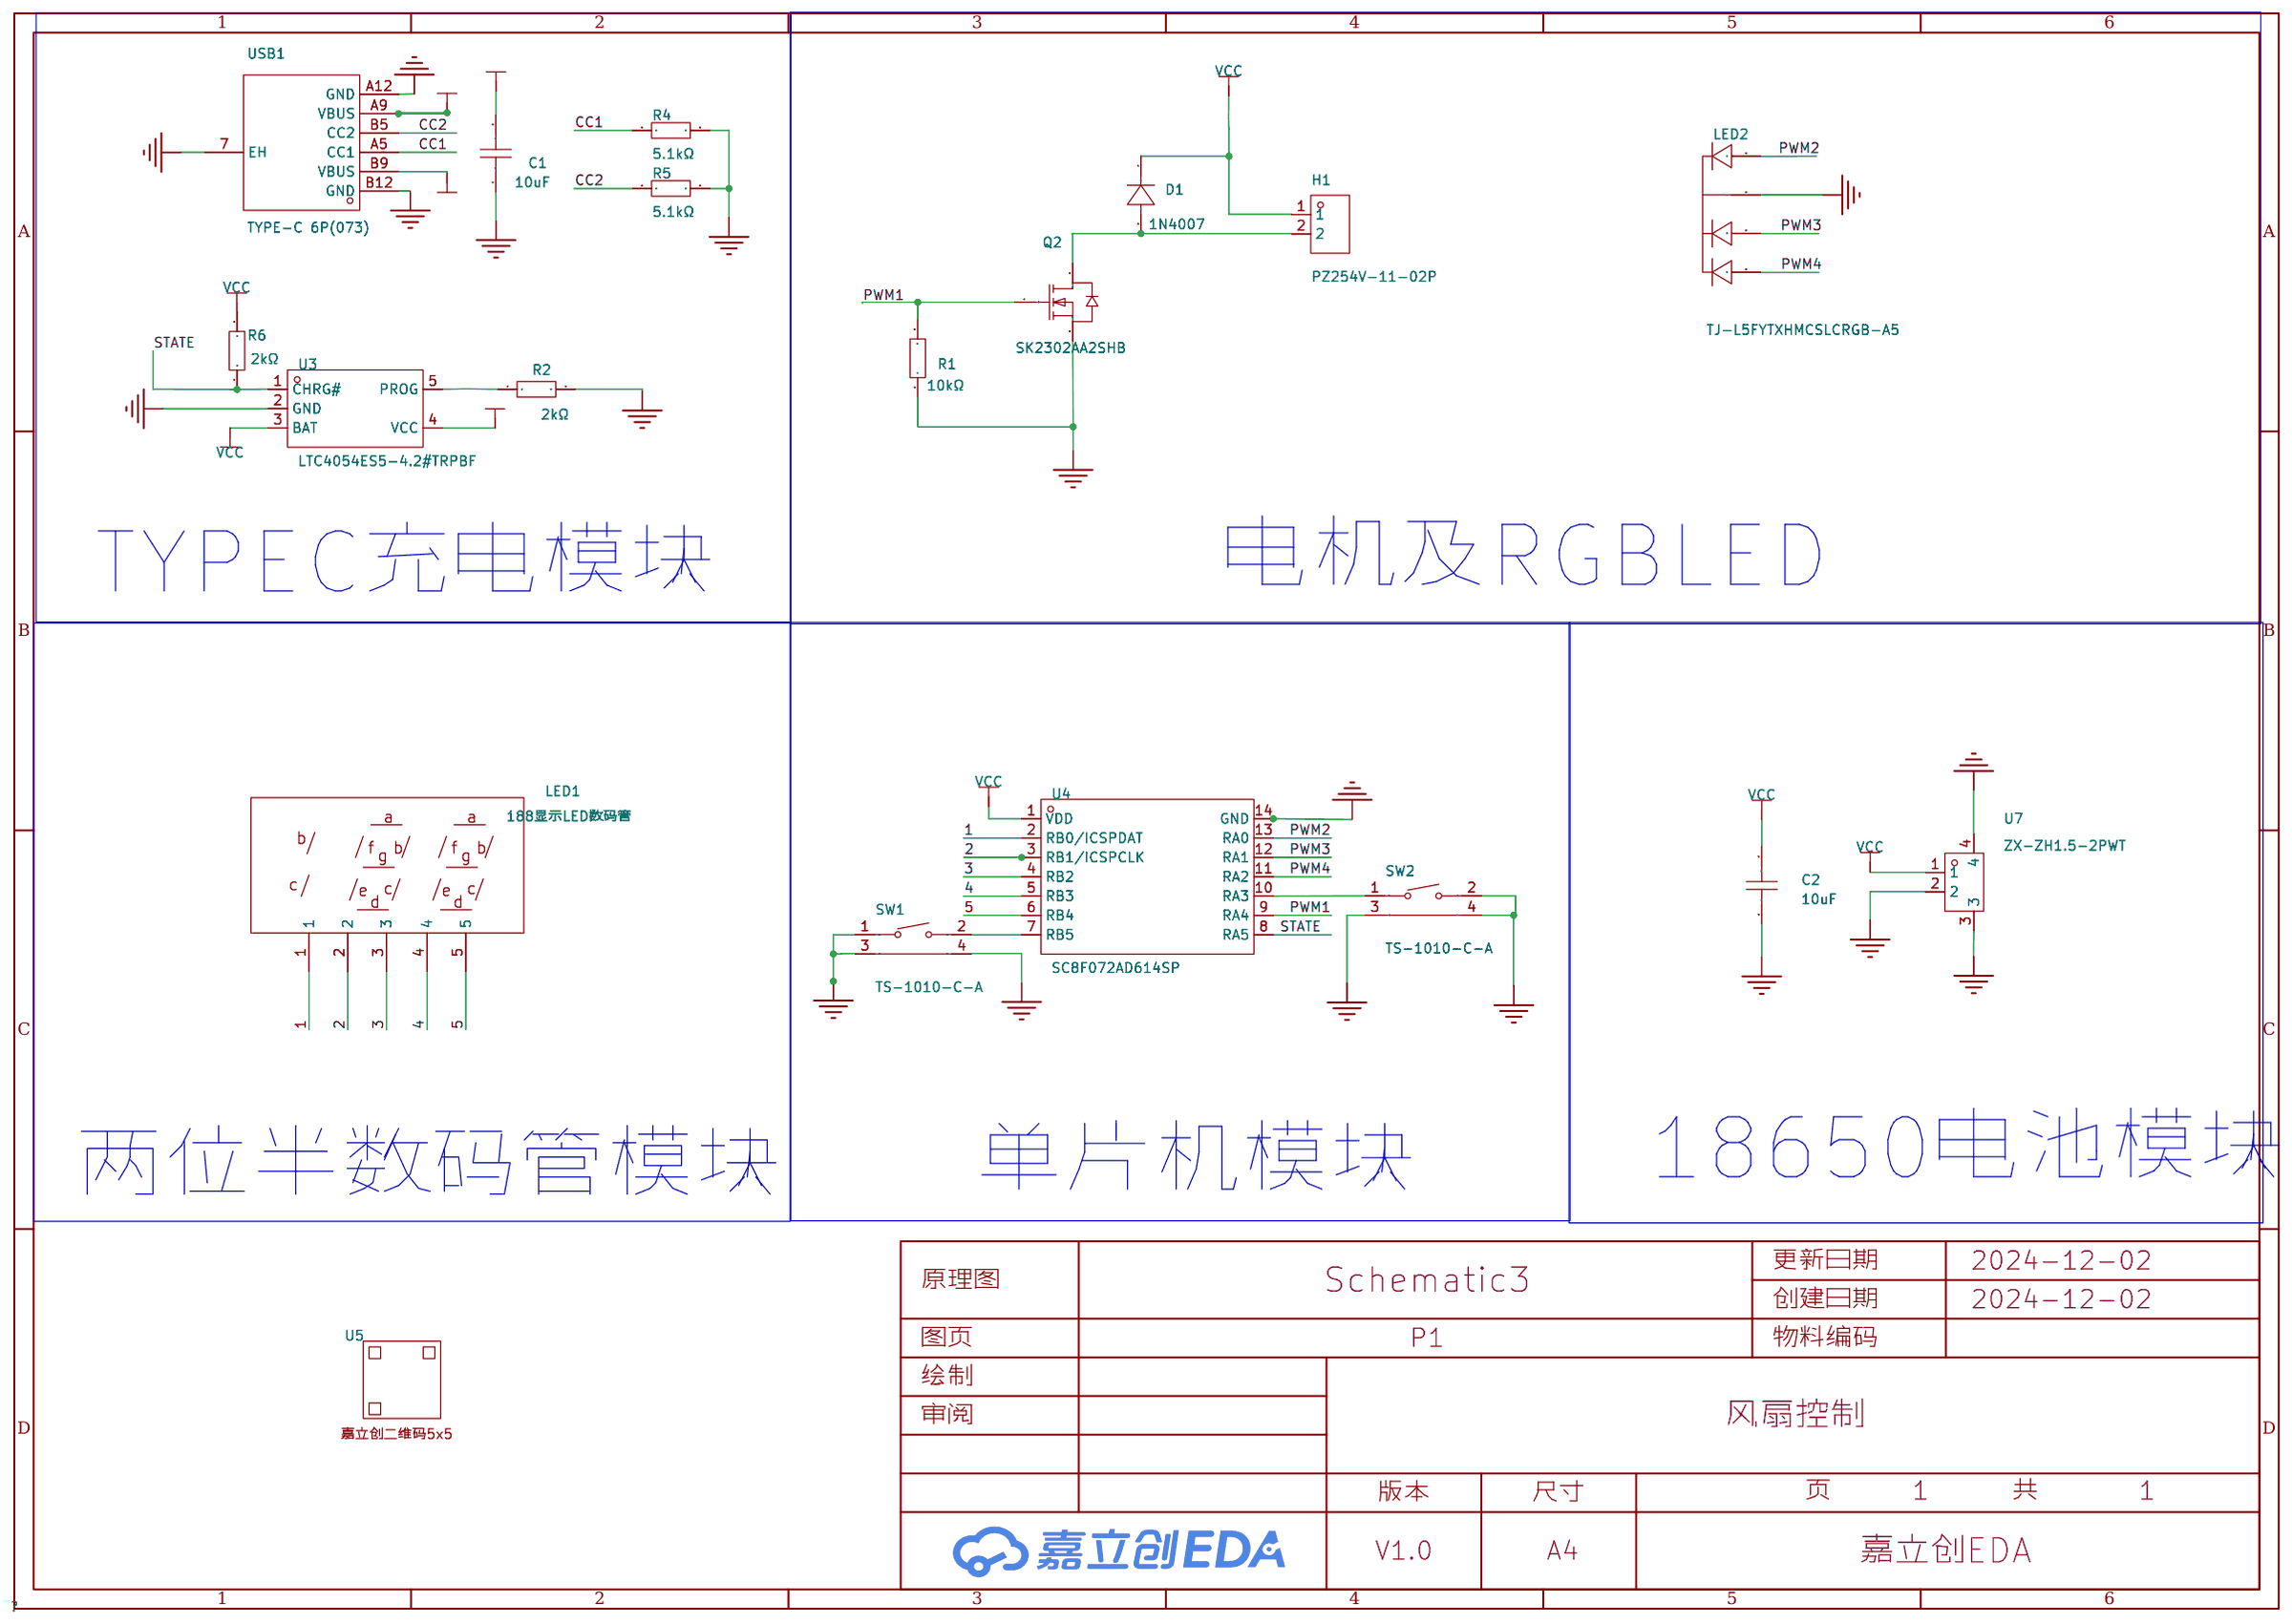
[diagram p2: schematic sheet]

## Parts
C1  10uF  [C0805]
C2  10uF  [C0805]
D1  1N4007  [SMA_L4.3-W2.5-LS5.0-RD]
H1  PZ254V-11-02P  [3.96-2P]
LED1  188显示LED数码管  [LED-TH_C9900059527]
LED2  TJ-L5FYTXHMCSLCRGB-A5  [LED-TH_4P-BD5.8-P1.30]
Q2  SK2302AA2SHB  [SOT-23-3_L2.9-W1.6-P1.90-LS2.8-BR]
R1  10kΩ  [R0805]
R2  2kΩ  [R0805]
R4  5.1kΩ  [R0805]
R5  5.1kΩ  [R0805]
R6  2kΩ  [R0805]
SW1  TS-1010-C-A  [KEY-SMD_TX-1010-X-X]
SW2  TS-1010-C-A  [KEY-SMD_TX-1010-X-X]
U3  LTC4054ES5-4.2#TRPBF  [TSOT-23-5_L2.9-W1.6-P0.95-LS2.8-BL]
U4  SC8F072AD614SP  [SOP-14_L8.7-W3.9-P1.27-LS6.0-BL]
U5  -  [JLC-QRCODE-5x5]
U7  ZX-ZH1.5-2PWT  [CONN-SMD_2P-P1.50_ZX-ZH1.5-2PWT]
USB1  TYPE-C 6P(073)  [TYPE-C-SMD_TYPE-C-6P_5]

## Library data of the parts
C1 C2 = CGA0805X5R106K350MT: 容值:10uF;精度:±10%;额定电压:35V;材质(温度系数):X5R;; LCSC Part Name: 10uF ±10% 35V; Supplier Part: C6119888; Manufacturer: HRE(芯声); Supplier Footprint: 0805; JLCPCB Part Class: Extended Part; Supplier: LCSC; Tolerance: ±10%; Voltage Rated: 35V; Temperature Coefficient: X5R
D1 = 1N4007_C727081: 二极管配置:独立式;正向压降(Vf):1.1V@1A;直流反向耐压(Vr):1kV;整流电流:1A;; LCSC Part Name: 电压:1kV 电流:1A; Supplier Part: C727081; Manufacturer: TWGMC(台湾迪嘉); Supplier Footprint: SMA(DO-214AC); Datasheet: https://atta.szlcsc.com/upload/public/pdf/source/20200828/C727079_3A05254382567072883400655AE0ED46.pdf; Supplier: LCSC; Diode Configuration: 独立式; Forward Voltage (Vf@If): 1.1V@1A; Reverse Voltage (Vr): 1kV; Rectified Current: 1A; Reverse Leakage Current: 5uA
H1 = PZ254V-11-02P: 插针结构:1x2P;间距:2.54mm;行距:-;圆针/方针:方针;安装类型:直插;排数:单排;总PIN位数:2P;额定电流:-;额定电压:-;配合针长度:6mm;塑高:2.5mm;端接针长度:3mm;触头材质:黄铜;触头镀层:-;工作温度范围:-40℃~+105℃;颜色:黑色;; LCSC Part Name: 间距:2.54mm 1x2P 直插 方针; Supplier Part: C492401; Manufacturer: XFCN(兴飞); Supplier Footprint: 插件,P=2.54mm; JLCPCB Part Class: 扩展库; Datasheet: https://atta.szlcsc.com/upload/public/pdf/source/20200309/C492401_A812433581A9B211A7FFA413ADDFF0E5.pdf; Supplier: LCSC; Pin Structure: 1x2P; Pitch: 2.54mm; Circluar Pins/Square Pins: 方针; Mounting Type: 直插; Number of Rows: 单排; Number of Pins: 2P; Length of Mating Pin: 6mm; Insulation Height: 2.5mm; Length of End Connection Pin: 3mm; Contact Material: 黄铜; Operating Temperature Range: -40℃~+105℃; Color: 黑色
LED1 = 188显示LED数码管: Supplier Part: C9900059527; Supplier Footprint: DIP; Supplier: LCSC
LED2 = TJ-L5FYTXHMCSLCRGB-A5: 5MM圆头共阴RGB,F5圆头共阴RGB,三色共阴RGB; LCSC Part Name: RGB三色; Supplier Part: C330759; Manufacturer: TOGIALED(统佳); Supplier Footprint: 插件,D=5mm; JLCPCB Part Class: 扩展库; Datasheet: https://atta.szlcsc.com/upload/public/pdf/source/20181220/C330759_95C409BF14EF1DFA3353C5A3EA3A53E5.pdf; Supplier: LCSC
Q2 = SK2302AA2SHB: 类型:1个N沟道;漏源电压(Vdss):18V;连续漏极电流(Id):3.6A;功率(Pd):700mW;导通电阻(RDS(on)@Vgs,Id):80mΩ@4.5V,3.6A;阈值电压(Vgs(th)@Id):1.3V@250uA;; LCSC Part Name: 1个N沟道 耐压:18V 电流:3.6A; Supplier Part: C118152; Manufacturer: SHIKUES(时科); Supplier Footprint: SC-59; JLCPCB Part Class: 扩展库; Datasheet: https://atta.szlcsc.com/upload/public/pdf/source/20191016/C118152_81A4E420DEC0954945921A05121CC0AB.pdf; Supplier: LCSC; Type: 1个N沟道; Drain Source Voltage (Vdss): 18V; Continuous Drain Current (Id): 3.6A; Power Dissipation (Pd): 700mW; Drain Source On Resistance (RDS(on)@Vgs,Id): 80mΩ@4.5V,3.6A; Gate Threshold Voltage (Vgs(th)@Id): 1.3V@250uA; Total Gate Charge (Qg@Vgs): 4nC; Input Capacitance (Ciss@Vds): 300pF@10V; Reverse Transfer Capacitance (Crss@Vds): 80pF@10V
R1 = 0805W8F1002T5E_C17414: 电阻类型:厚膜电阻;阻值:10kΩ;精度:±1%;功率:125mW;最大工作电压:150V;温度系数:±100ppm/℃;; LCSC Part Name: 10kΩ ±1% 125mW 厚膜电阻; Supplier Part: C17414; Manufacturer: UNI-ROYAL(厚声); Manufacturer Part: 0805W8F1002T5E; Supplier Footprint: 0805; JLCPCB Part Class: Basic Part; Datasheet: https://atta.szlcsc.com/upload/public/pdf/source/20200306/C422600_1E6D84923E4A46A82E41ADD87F860B5C.pdf; Supplier: LCSC; Type: 厚膜电阻; Tolerance: ±1%; Power(Watts): 125mW; Overload Voltage (Max): 150V; Temperature Coefficient: ±100ppm/℃; Operating Temperature Range: -55℃~+155℃
R2 R6 = 0805W8F2001T5E: 电阻类型:厚膜电阻;阻值:2kΩ;精度:±1%;功率:125mW;最大工作电压:150V;温度系数:±100ppm/℃;; LCSC Part Name: 2kΩ ±1% 125mW 厚膜电阻; Supplier Part: C17604; Manufacturer: UNI-ROYAL(厚声); Supplier Footprint: 0805; JLCPCB Part Class: Basic Part; Datasheet: https://atta.szlcsc.com/upload/public/pdf/source/20200306/C422600_1E6D84923E4A46A82E41ADD87F860B5C.pdf; Supplier: LCSC; Type: 厚膜电阻; Tolerance: ±1%; Power(Watts): 125mW; Overload Voltage (Max): 150V; Temperature Coefficient: ±100ppm/℃; Operating Temperature Range: -55℃~+155℃
R4 R5 = 0805W8F5101T5E: 电阻类型:厚膜电阻;阻值:5.1kΩ;精度:±1%;功率:125mW;最大工作电压:150V;温度系数:±100ppm/℃;; LCSC Part Name: 5.1kΩ ±1% 125mW 厚膜电阻; Supplier Part: C27834; Manufacturer: UNI-ROYAL(厚声); Supplier Footprint: 0805; JLCPCB Part Class: Basic Part; Datasheet: https://atta.szlcsc.com/upload/public/pdf/source/20200306/C422600_1E6D84923E4A46A82E41ADD87F860B5C.pdf; Supplier: LCSC; Type: 厚膜电阻; Tolerance: ±1%; Power(Watts): 125mW; Overload Voltage (Max): 150V; Temperature Coefficient: ±100ppm/℃; Operating Temperature Range: -55℃~+155℃
SW1 SW2 = TS-1010-C-A: 电路结构:单刀单掷;按钮形状:矩形按钮;作用力:260gf;安装方式:卧贴;开关长度:2.3mm;开关宽度:4.7mm;开关高度:3.5mm;带支架:不带;触点电流:50mA;额定电压(AC):-;额定电压(DC):12V;额定功率:-;绝缘电阻:-;带灯:无;机械寿命:10万次;; LCSC Part Name: 2.3*4.7*3.5mm 卧贴 轻触开关; Supplier Part: C692458; Manufacturer: XKB Connectivity(中国星坤); Supplier Footprint: SMD; JLCPCB Part Class: 扩展库; Datasheet: https://atta.szlcsc.com/upload/public/pdf/source/20211011/09621D275CE0F472C941775DFBBCCC96.pdf; Supplier: LCSC; Circuit: 单刀单掷; Actuator Style: 矩形按钮; Operating Force: 260gf; Mounting Style: 卧贴; Switch Length: 2.3mm; Switch Width: 4.7mm; Switch Height: 3.5mm; Strike Gundam: 不带; Contact Current: 50mA; Voltage Rating (DC): 12V; Actuator/Cap Color: 黑色; With Lamp: 无; Mechanical Life: 10万次; Operating Temperature: -30℃~+85℃
U3 = LTC4054ES5-4.2#TRPBF: 电源电压:6.5V;最大充电电流:800mA;电池类型:锂离子/聚合物;电池节数:1;; LCSC Part Name: 采用 ThinSOT 封装并具有热调节功能的独立线性锂离子电池充电器; Supplier Part: C462648; Manufacturer: ADI(亚德诺); Supplier Footprint: TSOT-23-5; JLCPCB Part Class: 扩展库; Datasheet: https://atta.szlcsc.com/upload/public/pdf/source/20170712/C117064_1499832277334814248.pdf; Supplier: LCSC; Supply Voltage: 6.5V; Maximum Charge Current: 800mA; Type of Battery: 锂离子/聚合物; Number of Cells: 1; Operating Temperature: -40℃~+85℃
U4 = SC8F072AD614SP: Supplier Part: C9900089081; Supplier Footprint: SOP14; JLCPCB Part Class: 扩展库; Supplier: LCSC
U5 = 嘉立创二维码5x5
U7 = ZX-ZH1.5-2PWT: 插针结构:1x2P;间距:1.5mm;安装方式:卧贴;参考系列:ZH;总PIN数:2P;排数:1;每排PIN数:2;行距:-;额定电流:1A;触头材质:黄铜;触头镀层:锡;工作温度范围:-25℃~+85℃;; LCSC Part Name: 1x2P 间距:1.5mm 卧贴 系列:ZH; Supplier Part: C19272405; Manufacturer: Megastar(兆星); Supplier Footprint: SMD,P=1.5mm,卧贴; JLCPCB Part Class: 扩展库; Datasheet: https://atta.szlcsc.com/upload/public/pdf/source/20231201/C5A824B953C40A6060EBF5A541254C86.pdf; Supplier: LCSC; Pins Structure: 1x2P; Pitch: 1.5mm; Mounting Style: 卧贴; Reference Series: ZH; Number of Pins: 2P; Number of Rows: 1; Number of PINs Per Row: 2; Current Rating (Max): 1A; Contact Material: 黄铜; Contact Plating: 锡; Operating Temperature Range: -25℃~+85℃
USB1 = TYPE-C 6P(073): 连接器类型:Type-C;标准:USB 3.1;公母:母;安装方式:卧贴;触点数量:6P;端口数量:1;额定电流 - 电源:3A;工作温度范围:-25℃~+85℃;; LCSC Part Name: Type-C 母 卧贴; Supplier Part: C668623; Manufacturer: SHOU HAN(首韩); Supplier Footprint: SMD; JLCPCB Part Class: 扩展库; Datasheet: https://atta.szlcsc.com/upload/public/pdf/source/20200618/C668623_A4B260DED7AC1949BAC6AE39E9F4CD80.pdf; Supplier: LCSC; Connector Type: Type-C; Standard: USB 3.1; Gender: 母; Mounting Style: 卧贴; Number of Contacts: 6P; Number of Ports: 1; Current Rating - Power (Max): 3A; Operating Temperature Range: -25℃~+85℃; Rated Voltage (Max): 5V; Connect-Disconnect Life: 1万次; Core Colour: 黑色

## Nets
+5V: U3.4(VCC) USB1.A9(VBUS) USB1.B9(VBUS)
GND: C1.1 C2.1 LED2.2(-) Q2.2(S) R1.1 R4.2 R5.2 SW2.2 SW2.3 SW2.4 U3.2(GND) U4.14(GND) U7.3 USB1.7(EH) USB1.A12(GND) USB1.B12(GND)
VCC: C2.2 D1.1(K) R6.1 U3.3(BAT) U4.1(VDD)
1: LED1.1
2: LED1.2
3: LED1.3
4: LED1.4
5: LED1.5 U4.6(RB4)
CC1: R4.1 USB1.A5(CC1)
CC2: R5.1 USB1.B5(CC2)
PWM1: Q2.1(G) R1.2 U4.9(RA4)
PWM2: U4.13(RA0)
PWM3: U4.12(RA1)
PWM4: U4.11(RA2)
STATE: R6.2 U3.1(CHRG#) U4.8(RA5)
$1N1166: R2.1 U3.5(PROG)
Net-(SW2-1): SW2.1 U4.10(RA3)

Not connected (* = marked no-connect by the designer): C1 2; D1 2(A); H1 1 2; LED2 1 3 4; Q2 3(D); R2 2; SW1 1 2 3 4; U4 2(RB0/ICSPDAT) 3(RB1/ICSPCLK) 4(RB2) 5(RB3) 7(RB5); U7 1 2 4

## Notes on the sheet
- 电机及RGBLED
- TYPEC充电模块
- 18650电池模块
- 两位半数码管模块
- 单片机模块

# Board PCB5
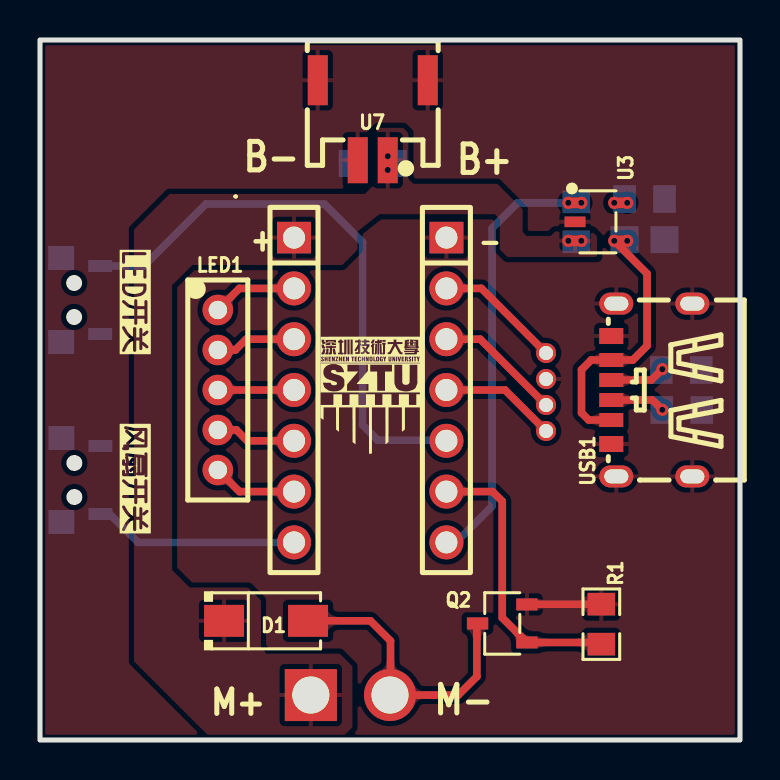
[diagram p3: board, top side]
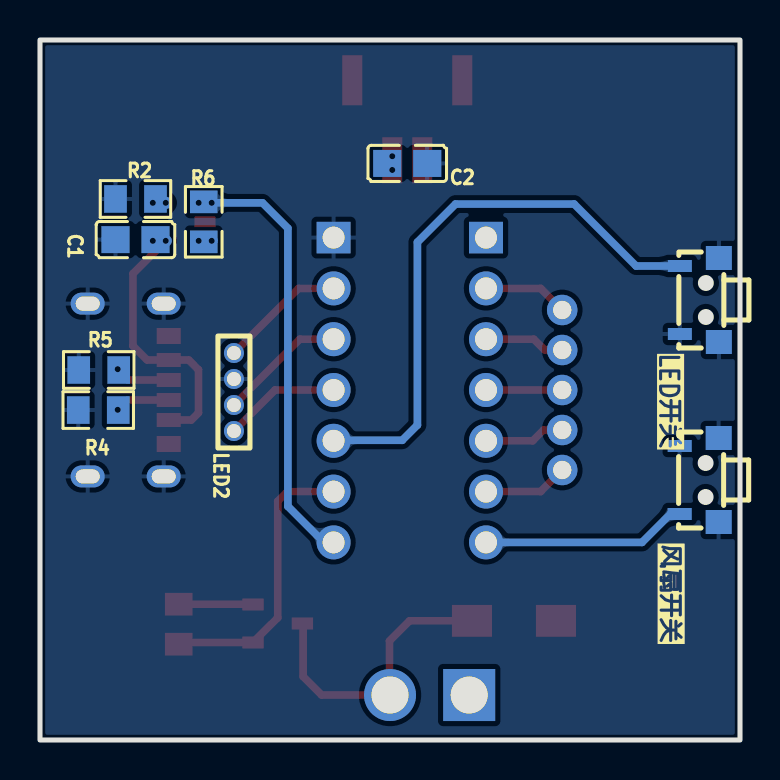
[diagram p4: board, bottom side, seen from below]

Outline 35 x 35 mm; copper layers: Top Layer, Bottom Layer. Coordinates in mm from the lower left corner of the outline.
Outline path: rectangle 0,35 35,0
Stack: Top Layer 0.035mm / Dielectric1 1.51mm FR4 er 4.5 / Bottom Layer 0.035mm

## Design rules (mm)
template: JLCPCB Capability(Two Layers Board)
spacing copperThickness1oz (default): track to track 0.102, other pairs 0.152 to 0.3
spacing copperThickness2oz: track to track 0.203, other pairs 0.152 to 0.3
track width copperThickness1oz (default): min 0.127, default 0.254, max 2.54
track width copperThickness2oz: min 0.203, default 0.254, max 2.54
differential pair differentialPair (default): width min 0.127, default 0.254, max 2.54; gap min 0.152, default 0.152
via viaSize (default): diameter min 0.5, default 0.61, max 10; hole min 0.3, default 0.305, max 6.3

## Placement (name value [footprint] x y rotation side)
-  PM254V-11-07-H85  [HDR-TH_7P-P2.54-V-F]  20.32 17.5 270 top
.  PM254V-11-07-H85  [HDR-TH_7P-P2.54-V-F]  12.7 17.5 270 top
C1  10uF  [C0805]  30.23 25.02 180 bottom
C2  10uF  [C0805]  16.64 28.83 0 bottom
D1  1N4007  [SMA_L4.3-W2.5-LS5.0-RD]  11.3 5.96 0 top
LED1  188显示LED数码管  [LED-TH_C9900059527]  8.89 17.5 270 top
LED2  TJ-L5FYTXHMCSLCRGB-A5  [LED-TH_4P-BD5.8-P1.30]  25.3 17.4 90 bottom
LED开关  TS-1010-C-A  [KEY-SMD_TX-1010-X-X]  2.03 22 270 bottom
M+  PZ254V-11-02P  [3.96-2P]  15.52 2.25 0 top
Q2  SK2302AA2SHB  [SOT-23-3_L2.9-W1.6-P1.90-LS2.8-BR]  23.11 5.83 0 top
R1  10kΩ  [R0805]  28.07 5.79 270 top
R2  2kΩ  [R0805]  30.23 27.05 0 bottom
R4  5.1kΩ  [R0805]  32.09 16.5 0 bottom
R5  5.1kΩ  [R0805]  32.06 18.5 0 bottom
R6  2kΩ  [R0805]  26.81 25.91 90 bottom
U3  LTC4054ES5-4.2#TRPBF  [TSOT-23-5_L2.9-W1.6-P0.95-LS2.8-BL]  27.9 25.91 270 top
U7  ZX-ZH1.5-2PWT  [CONN-SMD_2P-P1.50_ZX-ZH1.5-2PWT]  16.64 30.99 180 top
USB1  TYPE-C 6P(073)  [TYPE-C-SMD_TYPE-C-6P_5]  30.59 17.5 90 top
风扇开关  TS-1010-C-A  [KEY-SMD_TX-1010-X-X]  2.04 13 270 bottom

## Footprints (pads in the part's own frame, mm; a bottom-side part is the same pattern mirrored in y, then rotated)
3.96-2P
  rect 2.6x2.6 hole 1.85: 1(-1.98,0)
  round 2.6 hole 1.85: 2(1.98,0)
C0805
  rect 1.41x1.35 smd: 1(-1,0) 2(1,0)
CONN-SMD_2P-P1.50_ZX-ZH1.5-2PWT
  rect 1x2.3 smd: 1(-0.75,2) 2(0.75,2)
  rect 1x2.5 smd: 3(2.75,-2) 4(-2.75,-2)
HDR-TH_7P-P2.54-V-F
  rect 1.575x1.7 hole 1.1: 1(-7.62,0)
  round 1.7 hole 1.1: 2(-5.08,0) 3(-2.54,0) 4(0,0) 5(2.54,0) 6(5.08,0) 7(7.62,0)
KEY-SMD_TX-1010-X-X
  rect 0.6x1.2 smd: 1(-1.7,-0.975) 2(1.7,-0.975)
  rect 1.2x1.3 smd: 3(-2.1,0.975) 4(2.1,0.975)
LED-TH_4P-BD5.8-P1.30
  round 1 hole 0.7: 1(1.95,0) 2(0.65,0) 3(-0.65,0) 4(-1.95,0)
LED-TH_C9900059527
  round 1.524 hole 0.914: 1(-4,0) 2(-2,0) 3(0,0) 4(2,0) 5(4,0)
R0805
  rect 1.133x1.377 smd: 1(-1,0) 2(1,0)
SMA_L4.3-W2.5-LS5.0-RD
  rect 2x1.593 smd: 1(-2.1,0) 2(2.1,0)
SOT-23-3_L2.9-W1.6-P1.90-LS2.8-BR
  rect 1.07x0.6 smd: 1(1.235,-0.95) 2(1.235,0.95) 3(-1.235,0)
TSOT-23-5_L2.9-W1.6-P0.95-LS2.8-BL
  rect 0.532x1.045 smd: 1(-0.95,-1.147) 2(0,-1.147) 3(0.95,-1.147) 4(0.95,1.147) 5(-0.95,1.147)
TYPE-C-SMD_TYPE-C-6P_5
  oval 1.1x1.7 hole 0.7x1.2: 7(-4.32,1.775) 7(-4.32,-2.025) 7(4.32,1.775) 7(4.32,-2.025)
  rect 0.7x1.2 smd: A5(-0.5,2.025) A9(1.5,2.025) B5(0.5,2.025) B9(-1.5,2.025)
  rect 0.8x1.2 smd: A12(2.7,2.025) B12(-2.7,2.025)

## Nets
+5V: C1.2 U3.4 USB1.A9 USB1.B9
GND: -.1 C1.1 C2.1 LED2.2 LED开关.2 LED开关.3 LED开关.4 Q2.2 R1.1 R2.2 R4.2 R5.2 U3.2 U7.2 U7.3 U7.4 USB1.7 USB1.A12 USB1.B12 风扇开关.1 风扇开关.3 风扇开关.4
VCC: ..1 C2.2 D1.1 M+.1 R6.1 U3.3 U7.1
1: ..2 LED1.1
2: ..3 LED1.2
3: ..4 LED1.3
4: ..5 LED1.4
5: ..6 LED1.5
CC1: R4.1 USB1.A5
CC2: R5.1 USB1.B5
PWM1: -.6 Q2.1 R1.2
PWM2: -.2 LED2.1
PWM3: -.3 LED2.3
PWM4: -.4 LED2.4
STATE: -.7 R6.2 U3.1
$1N1158: D1.2 M+.2 Q2.3
$1N1166: R2.1 U3.5
$1N1213: ..7 风扇开关.2
$1N1512: -.5 LED开关.1

## Via types
v1: diameter 0.61, hole 0.305, Top Layer to Bottom Layer, 12 vias

## Routing (per net, layer and track width the routed paths; a pad name or vN(x,y) marks a point on that pad's centre or on a via; arc(x,y) is an arc through that point)
+5V: length 13.5
  Top Layer w0.381: USB1.B9 27.44,16 27.08,16.36 27.08,18.52 27.56,19 USB1.A9 29.64,19 30.35,19.71 30.35,23.32 v1(28.71,24.96)
  vias: v1(29.36,24.96)
GND: length 3.7
  Top Layer w0.381: 24.35,6.78 24.36,6.79 R1.1
VCC:
  vias: v1(17.39,29.19) v1(17.39,28.5) v1(26.42,24.96) v1(27.07,24.96)
1: length 4.3
  Top Layer w0.381: LED1.1 9.97,22.58 ..2
2: length 4
  Top Layer w0.381: ..3 10.31,20.04 9.77,19.5 LED1.2
3: length 3.8
  Top Layer w0.381: LED1.3 ..4
4: length 4
  Top Layer w0.381: ..5 10.36,14.96 9.82,15.5 LED1.4
5: length 4.3
  Top Layer w0.381: LED1.5 9.97,12.42 ..6
CC1: length 2.6
  Top Layer w0.381: v1(31.12,16.51) 30.62,17 28.69,17
CC2: length 2.6
  Top Layer w0.381: v1(31.12,18.54) 30.57,18 28.69,18
PWM1: length 14.3
  Top Layer w0.381: R1.2 27.98,4.88 24.35,4.88 23.11,6.11 23.11,11.94 22.63,12.42 -.6
PWM2: length 6.3
  Top Layer w0.381: LED2.1 22.07,22.58 -.2
PWM3: length 6.3
  Top Layer w0.381: LED2.3 22.01,20.04 -.3
PWM4: length 5.8
  Top Layer w0.381: -.4 23.25,17.5 LED2.4
STATE: length 21.3
  Bottom Layer w0.381: v1(26.42,26.86) 23.88,26.86 22.61,25.59 22.61,11.68 20.8,9.88 -.7
  vias: v1(27.07,26.86)
$1N1158: length 14.7
  Top Layer w0.381: Q2.3 21.84,5.79 21.84,3.17 20.92,2.25 M+.2 17.53,2.27 17.53,4.95 16.52,5.96 D1.2
$1N1166:
  vias: v1(28.71,26.86) v1(29.36,26.86)
$1N1213: length 10.3
  Bottom Layer w0.381: ..7 4.9,9.88 3.48,11.3 风扇开关.2
$1N1512: length 28.9
  Bottom Layer w0.381: -.5 20.29,14.99 16.89,14.99 16.13,15.75 16.13,24.89 14.22,26.8 8.29,26.8 5.19,23.7 LED开关.1

## Copper pours and planes (outline as drawn; the poured copper is in the pictures)
GND on Top Layer: -2.92,38.23 38.61,38.23 38.61,-2.29 -2.92,-2.29
GND on Bottom Layer: -2.41,35.81 38.61,35.81 38.61,-2.67 -2.41,-2.67
VCC on Top Layer: 25.53,25.2 25.76,25.43 27.6,25.43 27.86,25.18 27.86,24.15 23.37,24.15 22.99,24.53 22.99,26.03 22.74,26.29 16.97,26.29 15.88,25.43 15.88,24.51 15.11,23.75 7.62,23.75 6.6,22.73 6.6,8.51 7.49,7.62 10.41,7.62 11.05,6.98 11.05,4.69 11.3,4.32 14.99,4.32 15.62,3.68 15.62,0.64 15.24,0.25 8.38,0.25 4.7,3.94 4.7,25.53 6.48,27.31 16.25,27.31 16.64,27.7 16.64,30.35 16.89,30.61 18.16,30.61 18.41,30.35 18.41,28.07 18.67,27.81 22.86,27.81 24.13,26.54 24.13,25.4 24.33,25.2

Small or netless copper shapes (teardrops, artwork), in the pictures only: 34 on Top Layer, 6 on Bottom Layer

## Text on the board
Top Silkscreen Layer: + | B- | M- | B+ | 风扇开关 | LED开关

# Board PCB3
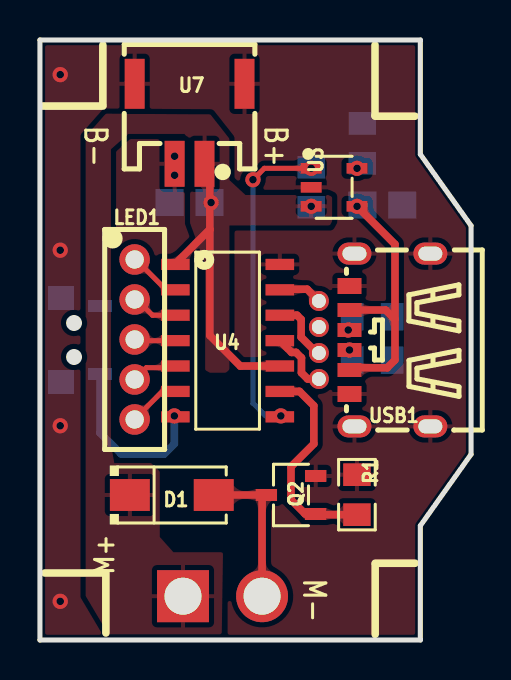
[diagram p5: board, top side]
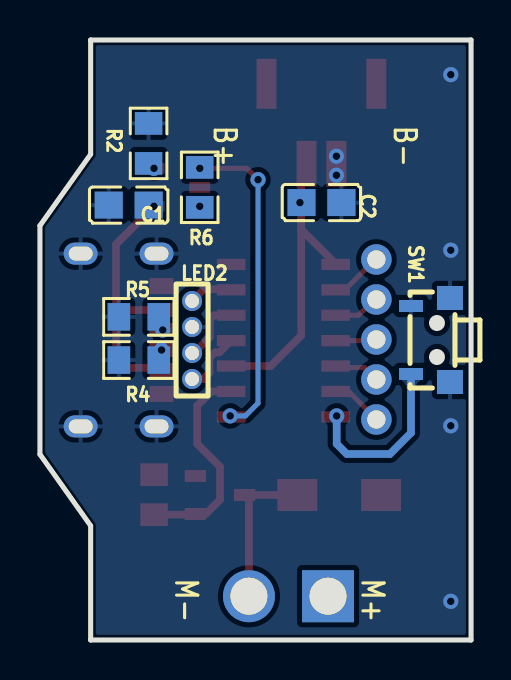
[diagram p6: board, bottom side, seen from below]

Outline 21.59 x 30 mm; copper layers: Top Layer, Bottom Layer. Coordinates in mm from the lower left corner of the outline.
Outline path: 0,30 0,0 19.05,0 19.05,5.72 21.59,9.28 21.59,20.72 19.05,24.28 19.05,30 0,30
Stack: Top Layer 0.035mm / Dielectric1 1.51mm FR4 er 4.5 / Bottom Layer 0.035mm

## Design rules (mm)
template: JLCPCB Capability(Two Layers Board)
spacing copperThickness1oz (default): track to track 0.102, other pairs 0.152 to 0.3
spacing copperThickness2oz: track to track 0.203, other pairs 0.152 to 0.3
track width copperThickness1oz (default): min 0.127, default 0.254, max 2.54
track width copperThickness2oz: min 0.203, default 0.254, max 2.54
differential pair differentialPair (default): width min 0.127, default 0.254, max 2.54; gap min 0.152, default 0.152
via viaSize (default): diameter min 0.5, default 0.61, max 10; hole min 0.3, default 0.305, max 6.3

## Placement (name value [footprint] x y rotation side)
C1  10uF  [C0805]  17.15 21.75 180 bottom
C2  10uF  [C0805]  7.49 21.87 0 bottom
D1  1N4007  [SMA_L4.3-W2.5-LS5.0-RD]  6.6 7.25 0 top
LED1  188显示LED数码管  [LED-TH_C9900059527]  4.74 15.03 270 top
LED2  TJ-L5FYTXHMCSLCRGB-A5  [LED-TH_4P-BD5.8-P1.30]  13.97 15 90 bottom
M+  PZ254V-11-02P  [3.96-2P]  9.14 2.19 0 top
Q2  SK2302AA2SHB  [SOT-23-3_L2.9-W1.6-P1.90-LS2.8-BR]  12.57 7.25 0 top
R1  10kΩ  [R0805]  15.88 7.27 270 top
R2  2kΩ  [R0805]  16.15 24.83 90 bottom
R4  5.1kΩ  [R0805]  16.64 14 0 bottom
R5  5.1kΩ  [R0805]  16.64 16.16 0 bottom
R6  2kΩ  [R0805]  13.59 22.63 90 bottom
SW1  TS-1010-C-A  [KEY-SMD_TX-1010-X-X]  2.03 15 270 bottom
U3  LTC4054ES5-4.2#TRPBF  [TSOT-23-5_L2.9-W1.6-P0.95-LS2.8-BL]  14.73 22.63 270 top
U4  SC8F072AD614SP  [SOP-14_L8.7-W3.9-P1.27-LS6.0-BL]  9.4 14.97 270 top
U7  ZX-ZH1.5-2PWT  [CONN-SMD_2P-P1.50_ZX-ZH1.5-2PWT]  7.49 25.81 180 top
USB1  TYPE-C 6P(073)  [TYPE-C-SMD_TYPE-C-6P_5]  17.53 15 90 top

## Footprints (pads in the part's own frame, mm; a bottom-side part is the same pattern mirrored in y, then rotated)
3.96-2P
  rect 2.6x2.6 hole 1.85: 1(-1.98,0)
  round 2.6 hole 1.85: 2(1.98,0)
C0805
  rect 1.41x1.35 smd: 1(-1,0) 2(1,0)
CONN-SMD_2P-P1.50_ZX-ZH1.5-2PWT
  rect 1x2.3 smd: 1(-0.75,2) 2(0.75,2)
  rect 1x2.5 smd: 3(2.75,-2) 4(-2.75,-2)
KEY-SMD_TX-1010-X-X
  rect 0.6x1.2 smd: 1(-1.7,-0.975) 2(1.7,-0.975)
  rect 1.2x1.3 smd: 3(-2.1,0.975) 4(2.1,0.975)
LED-TH_4P-BD5.8-P1.30
  round 1 hole 0.7: 1(1.95,0) 2(0.65,0) 3(-0.65,0) 4(-1.95,0)
LED-TH_C9900059527
  round 1.524 hole 0.914: 1(-4,0) 2(-2,0) 3(0,0) 4(2,0) 5(4,0)
R0805
  rect 1.133x1.377 smd: 1(-1,0) 2(1,0)
SMA_L4.3-W2.5-LS5.0-RD
  rect 2x1.593 smd: 1(-2.1,0) 2(2.1,0)
SOP-14_L8.7-W3.9-P1.27-LS6.0-BL
  rect 0.56x1.43 smd: 1(-3.81,-2.615) 2(-2.54,-2.615) 3(-1.27,-2.615) 4(0,-2.615) 5(1.27,-2.615) 6(2.54,-2.615) 7(3.81,-2.615) 8(3.81,2.615) 9(2.54,2.615) 10(1.27,2.615) 11(0,2.615) 12(-1.27,2.615) 13(-2.54,2.615) 14(-3.81,2.615)
SOT-23-3_L2.9-W1.6-P1.90-LS2.8-BR
  rect 1.07x0.6 smd: 1(1.235,-0.95) 2(1.235,0.95) 3(-1.235,0)
TSOT-23-5_L2.9-W1.6-P0.95-LS2.8-BL
  rect 0.532x1.045 smd: 1(-0.95,-1.147) 2(0,-1.147) 3(0.95,-1.147) 4(0.95,1.147) 5(-0.95,1.147)
TYPE-C-SMD_TYPE-C-6P_5
  oval 1.1x1.7 hole 0.7x1.2: 7(-4.32,1.775) 7(-4.32,-2.025) 7(4.32,1.775) 7(4.32,-2.025)
  rect 0.7x1.2 smd: A5(-0.5,2.025) A9(1.5,2.025) B5(0.5,2.025) B9(-1.5,2.025)
  rect 0.8x1.2 smd: A12(2.7,2.025) B12(-2.7,2.025)

## Nets
+5V: C1.2 U3.4 USB1.A9 USB1.B9
GND: C1.1 C2.1 LED2.2 Q2.2 R1.1 R2.2 R4.2 R5.2 SW1.1 SW1.3 SW1.4 U3.2 U4.14 U7.2 U7.3 U7.4 USB1.7 USB1.A12 USB1.B12
VCC: C2.2 D1.1 M+.1 R6.1 U3.3 U4.1 U4.10 U7.1
1: LED1.1 U4.2
2: LED1.2 U4.3
3: LED1.3 U4.4
4: LED1.4 U4.5
5: LED1.5 U4.6
CC1: R4.1 USB1.A5
CC2: R5.1 USB1.B5
PWM1: Q2.1 R1.2 U4.9
PWM2: LED2.1 U4.13
PWM3: LED2.3 U4.12
PWM4: LED2.4 U4.11
STATE: R6.2 U3.1 U4.8
$1N991: D1.2 M+.2 Q2.3
$1N2007: R2.1 U3.5
$1N8404: SW1.2 U4.7

## Via types
v1: diameter 0.762, hole 0.381, Top Layer to Bottom Layer, 16 vias

## Routing (per net, layer and track width the routed paths; a pad name or vN(x,y) marks a point on that pad's centre or on a via; arc(x,y) is an arc through that point)
+5V: length 13.4
  Top Layer w0.381: 17.78,16.03 17.31,16.5 USB1.A9 ; 17.78,16.03 17.78,19.78 v1(15.88,21.68) ; 17.78,16.03 17.78,14 17.39,13.61 15.61,13.61 USB1.B9
GND: length 1
  Top Layer w0.381: v1(6.74,24.19) v1(6.74,23.24)
  vias: v1(1.02,28.27) v1(1.02,19.49) v1(1.02,10.71) v1(1.02,1.93)
VCC: length 15.8
  Top Layer w0.381: 6.78,18.81 8.51,20.54 ; 8.51,20.54 8.51,15.22 10.03,13.7 U4.10 ; 8.51,20.54 8.51,24.05 8.24,24.32
  vias: v1(8.57,21.87) v1(13.58,21.68)
1: length 2.6
  Top Layer w0.254: U4.2 6.32,17.51 4.83,19
2: length 2.4
  Top Layer w0.254: U4.3 5.63,16.24 4.85,17.03 LED1.2
3: length 2
  Top Layer w0.254: U4.4 4.86,14.97 4.83,15
4: length 2.3
  Top Layer w0.254: LED1.4 5.33,13.62 6.7,13.62 U4.5
5: length 2.7
  Top Layer w0.254: 4.7,11 6.13,12.43 U4.6
CC1:
  vias: v1(15.5,14.5)
CC2:
  vias: v1(15.44,15.5)
PWM1: length 10.8
  Top Layer w0.381: R1.2 13.84,6.27 Q2.1 13.28,6.3 12.57,7.01 12.57,8.66 13.72,9.81 13.72,11.71 13,12.43 U4.9
PWM2: length 2.2
  Top Layer w0.381: 12.01,17.54 13.38,17.54 LED2.1
PWM3: length 3.3
  Top Layer w0.381: LED2.3 13.87,14.35 13.08,15.14 13.08,16.03 12.87,16.24 U4.12
PWM4: length 3.2
  Top Layer w0.381: LED2.4 13.41,13.05 13.1,13.36 13.1,14.11 12.83,14.38 12.6,14.38 U4.11
STATE: length 16
  Top Layer w0.254: v1(10.67,23.02) 11.24,23.58 v1(13.58,23.58)
  Bottom Layer w0.254: v1(10.67,23.02) 10.67,11.84 11.3,11.2 v1(12.06,11.2)
$1N991: length 7.8
  Top Layer w0.381: M+.2 11.12,7.04 Q2.3 D1.2
$1N2007:
  vias: v1(15.88,23.58)
$1N8404: length 8.7
  Bottom Layer w0.381: SW1.2 3.01,10.36 4.06,9.3 6.22,9.3 6.73,9.81 v1(6.73,11.2)

## Copper pours and planes (outline as drawn; the poured copper is in the pictures)
GND on Top Layer: -1.27,31.78 24,31.78 24,-2.51 -1.27,-2.51
GND on Bottom Layer: -1.91,31.52 23.5,31.52 23.5,-2.89 -1.91,-2.89
VCC on Top Layer: 4.42,25.3 7.24,25.3 7.52,24.94 7.52,20.84 8.27,18.78 8.27,13.5 8.51,13.36 9.31,13.36 9.49,13.52 9.49,20.73 14.52,20.73 14.63,20.93 14.63,22.16 14.44,22.25 10.29,22.25 9.49,22.99 9.49,25.07 8.53,26.28 3.3,26.32 2.29,25.17 2.29,2.2 3.43,0.28 9.11,0.28 9.17,4.39 6.68,4.39 6,5.15 6,8.43 5.56,8.84 3.73,8.84 3.56,9.79 3.56,24.54

Small or netless copper shapes (teardrops, artwork), in the pictures only: 36 on Top Layer, 4 on Bottom Layer

## Text on the board
Bottom Silkscreen Layer: B- | M+ | B+ | M-
Top Silkscreen Layer: B- | B+ | M-

# Board PCB6
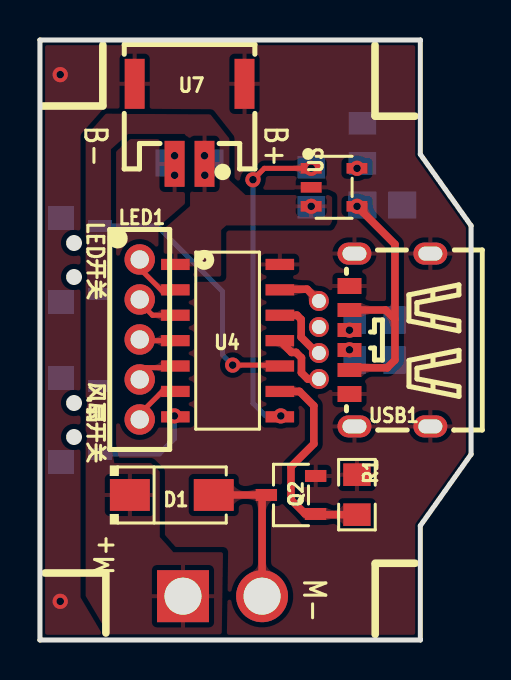
[diagram p7: board, top side]
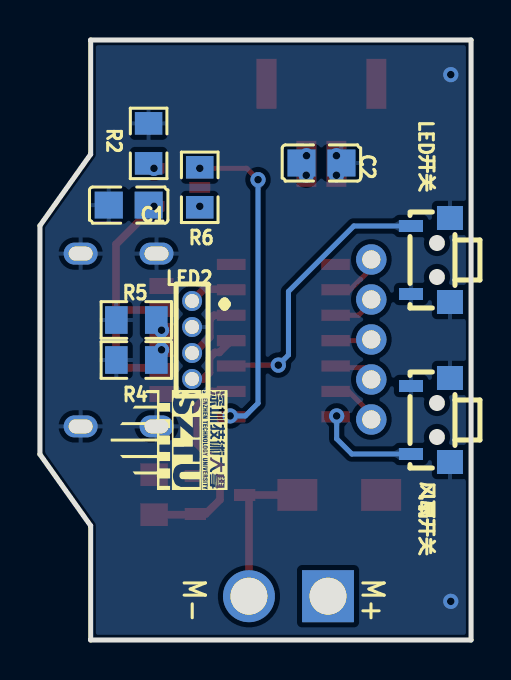
[diagram p8: board, bottom side, seen from below]

Outline 21.59 x 30 mm; copper layers: Top Layer, Bottom Layer. Coordinates in mm from the lower left corner of the outline.
Outline path: 0,30 0,0 19.05,0 19.05,5.72 21.59,9.28 21.59,20.72 19.05,24.28 19.05,30 0,30
Stack: Top Layer 0.035mm / Dielectric1 1.51mm FR4 er 4.5 / Bottom Layer 0.035mm

## Design rules (mm)
template: JLCPCB Capability(Two Layers Board)
spacing copperThickness1oz (default): track to track 0.102, other pairs 0.152 to 0.3
spacing copperThickness2oz: track to track 0.203, other pairs 0.152 to 0.3
track width copperThickness1oz (default): min 0.127, default 0.254, max 2.54
track width copperThickness2oz: min 0.203, default 0.254, max 2.54
differential pair differentialPair (default): width min 0.127, default 0.254, max 2.54; gap min 0.152, default 0.152
via viaSize (default): diameter min 0.5, default 0.61, max 10; hole min 0.3, default 0.305, max 6.3

## Placement (name value [footprint] x y rotation side)
C1  10uF  [C0805]  17.15 21.75 180 bottom
C2  10uF  [C0805]  7.49 23.85 0 bottom
D1  1N4007  [SMA_L4.3-W2.5-LS5.0-RD]  6.6 7.25 0 top
LED1  188显示LED数码管  [LED-TH_C9900059527]  5 15.03 270 top
LED2  TJ-L5FYTXHMCSLCRGB-A5  [LED-TH_4P-BD5.8-P1.30]  13.97 15 90 bottom
LED开关  TS-1010-C-A  [KEY-SMD_TX-1010-X-X]  2.03 19 270 bottom
M+  PZ254V-11-02P  [3.96-2P]  9.14 2.19 0 top
Q2  SK2302AA2SHB  [SOT-23-3_L2.9-W1.6-P1.90-LS2.8-BR]  12.57 7.25 0 top
R1  10kΩ  [R0805]  15.88 7.27 270 top
R2  2kΩ  [R0805]  16.15 24.83 90 bottom
R4  5.1kΩ  [R0805]  16.76 14 0 bottom
R5  5.1kΩ  [R0805]  16.76 16 0 bottom
R6  2kΩ  [R0805]  13.59 22.63 90 bottom
U3  LTC4054ES5-4.2#TRPBF  [TSOT-23-5_L2.9-W1.6-P0.95-LS2.8-BL]  14.73 22.63 270 top
U4  SC8F072AD614SP  [SOP-14_L8.7-W3.9-P1.27-LS6.0-BL]  9.4 14.97 270 top
U7  ZX-ZH1.5-2PWT  [CONN-SMD_2P-P1.50_ZX-ZH1.5-2PWT]  7.49 25.81 180 top
USB1  TYPE-C 6P(073)  [TYPE-C-SMD_TYPE-C-6P_5]  17.53 15 90 top
风扇开关  TS-1010-C-A  [KEY-SMD_TX-1010-X-X]  2.03 11 270 bottom

## Footprints (pads in the part's own frame, mm; a bottom-side part is the same pattern mirrored in y, then rotated)
3.96-2P
  rect 2.6x2.6 hole 1.85: 1(-1.98,0)
  round 2.6 hole 1.85: 2(1.98,0)
C0805
  rect 1.41x1.35 smd: 1(-1,0) 2(1,0)
CONN-SMD_2P-P1.50_ZX-ZH1.5-2PWT
  rect 1x2.3 smd: 1(-0.75,2) 2(0.75,2)
  rect 1x2.5 smd: 3(2.75,-2) 4(-2.75,-2)
KEY-SMD_TX-1010-X-X
  rect 0.6x1.2 smd: 1(-1.7,-0.975) 2(1.7,-0.975)
  rect 1.2x1.3 smd: 3(-2.1,0.975) 4(2.1,0.975)
LED-TH_4P-BD5.8-P1.30
  round 1 hole 0.7: 1(1.95,0) 2(0.65,0) 3(-0.65,0) 4(-1.95,0)
LED-TH_C9900059527
  round 1.524 hole 0.914: 1(-4,0) 2(-2,0) 3(0,0) 4(2,0) 5(4,0)
R0805
  rect 1.133x1.377 smd: 1(-1,0) 2(1,0)
SMA_L4.3-W2.5-LS5.0-RD
  rect 2x1.593 smd: 1(-2.1,0) 2(2.1,0)
SOP-14_L8.7-W3.9-P1.27-LS6.0-BL
  rect 0.56x1.43 smd: 1(-3.81,-2.615) 2(-2.54,-2.615) 3(-1.27,-2.615) 4(0,-2.615) 5(1.27,-2.615) 6(2.54,-2.615) 7(3.81,-2.615) 8(3.81,2.615) 9(2.54,2.615) 10(1.27,2.615) 11(0,2.615) 12(-1.27,2.615) 13(-2.54,2.615) 14(-3.81,2.615)
SOT-23-3_L2.9-W1.6-P1.90-LS2.8-BR
  rect 1.07x0.6 smd: 1(1.235,-0.95) 2(1.235,0.95) 3(-1.235,0)
TSOT-23-5_L2.9-W1.6-P0.95-LS2.8-BL
  rect 0.532x1.045 smd: 1(-0.95,-1.147) 2(0,-1.147) 3(0.95,-1.147) 4(0.95,1.147) 5(-0.95,1.147)
TYPE-C-SMD_TYPE-C-6P_5
  oval 1.1x1.7 hole 0.7x1.2: 7(-4.32,1.775) 7(-4.32,-2.025) 7(4.32,1.775) 7(4.32,-2.025)
  rect 0.7x1.2 smd: A5(-0.5,2.025) A9(1.5,2.025) B5(0.5,2.025) B9(-1.5,2.025)
  rect 0.8x1.2 smd: A12(2.7,2.025) B12(-2.7,2.025)

## Nets
+5V: C1.2 U3.4 USB1.A9 USB1.B9
GND: C1.1 C2.1 LED2.2 LED开关.2 LED开关.3 LED开关.4 Q2.2 R1.1 R2.2 R4.2 R5.2 U3.2 U4.14 U7.2 U7.3 U7.4 USB1.7 USB1.A12 USB1.B12 风扇开关.1 风扇开关.3 风扇开关.4
VCC: C2.2 D1.1 M+.1 R6.1 U3.3 U4.1 U7.1
1: LED1.1 U4.2
2: LED1.2 U4.3
3: LED1.3 U4.4
4: LED1.4 U4.5
5: LED1.5 U4.6
CC1: R4.1 USB1.A5
CC2: R5.1 USB1.B5
PWM1: Q2.1 R1.2 U4.9
PWM2: LED2.1 U4.13
PWM3: LED2.3 U4.12
PWM4: LED2.4 U4.11
STATE: R6.2 U3.1 U4.8
$1N1158: D1.2 M+.2 Q2.3
$1N1166: R2.1 U3.5
$1N1333: LED开关.1 U4.10
$1N1388: U4.7 风扇开关.2

## Via types
v1: diameter 0.762, hole 0.381, Top Layer to Bottom Layer, 16 vias

## Routing (per net, layer and track width the routed paths; a pad name or vN(x,y) marks a point on that pad's centre or on a via; arc(x,y) is an arc through that point)
+5V: length 13.4
  Top Layer w0.381: 17.78,16.03 17.31,16.5 USB1.A9 ; 17.78,16.03 17.78,14 17.39,13.61 15.61,13.61 USB1.B9 ; 17.78,16.03 17.78,19.78 v1(15.88,21.68)
GND: length 1
  Top Layer w0.381: 6.74,24.19 v1(6.74,23.24)
  vias: v1(1.02,28.27) v1(1.02,1.93) v1(6.74,24.22)
VCC:
  vias: v1(8.24,24.22) v1(8.25,23.24) v1(13.58,21.68)
1: length 2.8
  Top Layer w0.254: 4.83,19 5,18.83 5,18.58 6.19,17.38 6.66,17.38 U4.2
2: length 2.4
  Top Layer w0.254: 4.74,17.03 4.85,17.03 5.63,16.24 U4.3
3: length 2
  Top Layer w0.254: U4.4 4.86,14.97 4.83,15
4: length 2.2
  Top Layer w0.254: U4.5 6.7,13.62 5.33,13.62 5,13.28 LED1.4
5: length 2.5
  Top Layer w0.254: LED1.5 5,11.3 6.13,12.43 U4.6
CC1:
  vias: v1(15.5,14.51)
CC2:
  vias: v1(15.5,15.49)
PWM1: length 10.8
  Top Layer w0.381: U4.9 13,12.43 13.72,11.71 13.72,9.81 12.57,8.66 12.57,7.01 13.28,6.3 Q2.1 13.84,6.27 R1.2
PWM2: length 2.2
  Top Layer w0.381: 12.01,17.54 13.38,17.54 LED2.1
PWM3: length 3.3
  Top Layer w0.381: U4.12 12.87,16.24 13.08,16.03 13.08,15.14 13.87,14.35 LED2.3
PWM4: length 3.2
  Top Layer w0.381: U4.11 12.6,14.38 12.83,14.38 13.1,14.11 13.1,13.36 13.41,13.05 LED2.4
STATE: length 16
  Top Layer w0.254: v1(10.67,23.02) 11.24,23.58 v1(13.58,23.58)
  Bottom Layer w0.254: v1(10.67,23.02) 10.67,11.84 11.3,11.2 v1(12.06,11.2)
$1N1158: length 7.8
  Top Layer w0.381: D1.2 Q2.3 11.12,7.04 M+.2
$1N1166:
  vias: v1(15.88,23.58)
$1N1333: length 13.8
  Top Layer w0.254: v1(9.65,13.74) 11.97,13.74 U4.10
  Bottom Layer w0.254: v1(9.65,13.74) 9.14,14.25 9.14,17.43 5.87,20.7 LED开关.1
$1N1388: length 5.2
  Bottom Layer w0.254: 风扇开关.2 5.97,9.3 6.73,10.06 v1(6.73,11.2)

## Copper pours and planes (outline as drawn; the poured copper is in the pictures)
GND on Top Layer: -2.29,31.78 23.88,31.78 23.88,-3.02 -2.29,-3.02
GND on Bottom Layer: -5.33,34.44 25.4,34.44 25.4,-3.53 -5.33,-3.53
VCC on Top Layer: 4.42,25.3 7.24,25.3 7.52,24.94 7.52,21.7 6.19,20.54 6.19,18.17 9.08,18.17 9.08,20.51 9.33,20.73 14.52,20.73 14.63,20.93 14.63,22.16 14.44,22.25 10.29,22.25 9.49,22.99 9.49,25.07 8.53,26.28 3.3,26.32 2.29,25.17 2.29,2.2 3.43,0.28 9.11,0.28 9.17,4.39 6.68,4.39 6,5.15 6,8.43 5.56,8.84 3.73,8.84 3.56,9.79 3.56,24.54

Small or netless copper shapes (teardrops, artwork), in the pictures only: 48 on Top Layer, 8 on Bottom Layer

## Text on the board
Bottom Silkscreen Layer: M+ | M- | .
Top Silkscreen Layer: B- | B+ | M- | 风扇开关 | LED开关
